# EAGLE schematic rel-8bit-computer (EAGLE 9.6.2)
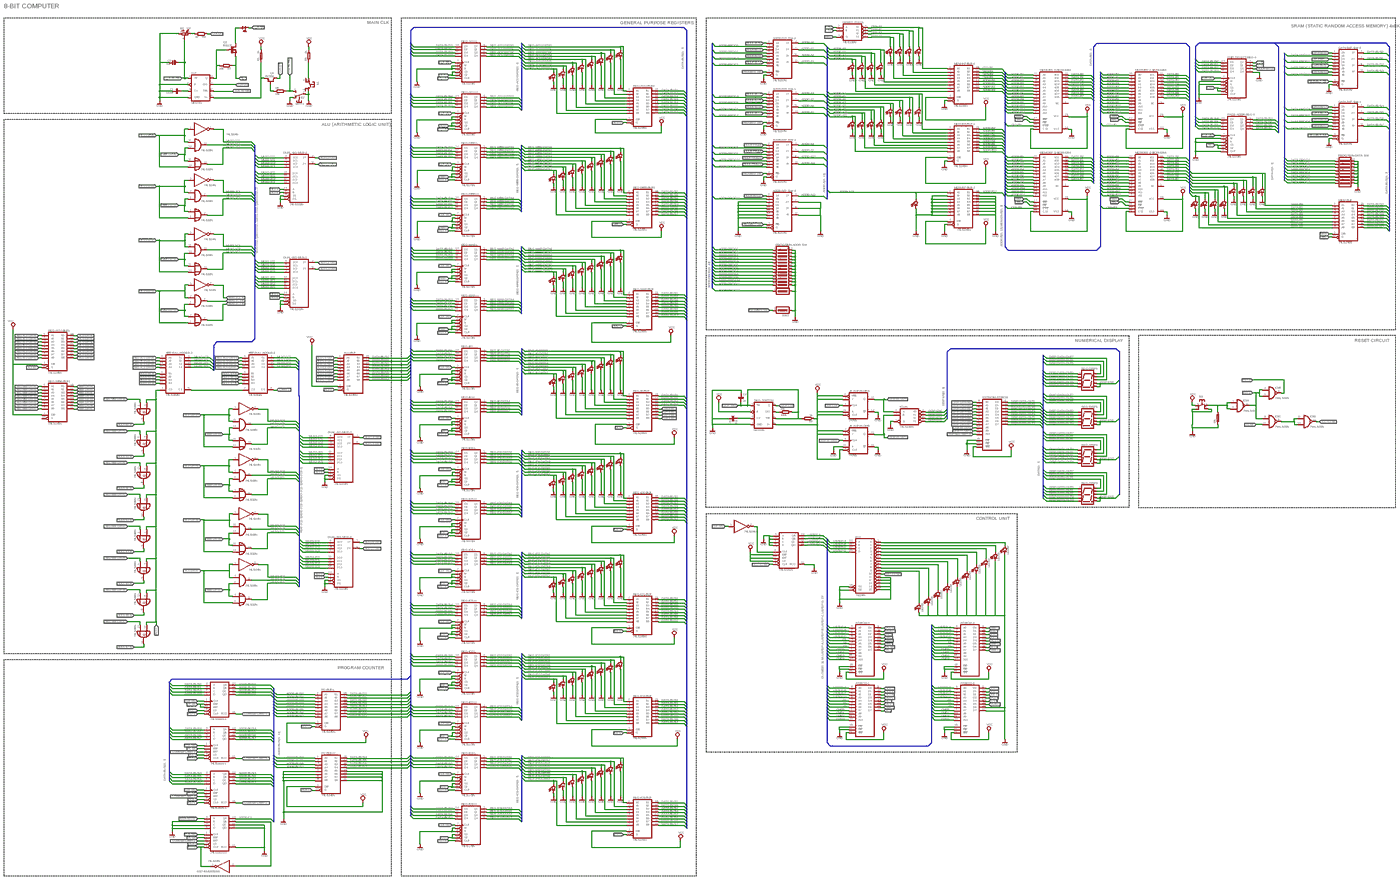
[diagram p0: schematic, sheet 1, overview]
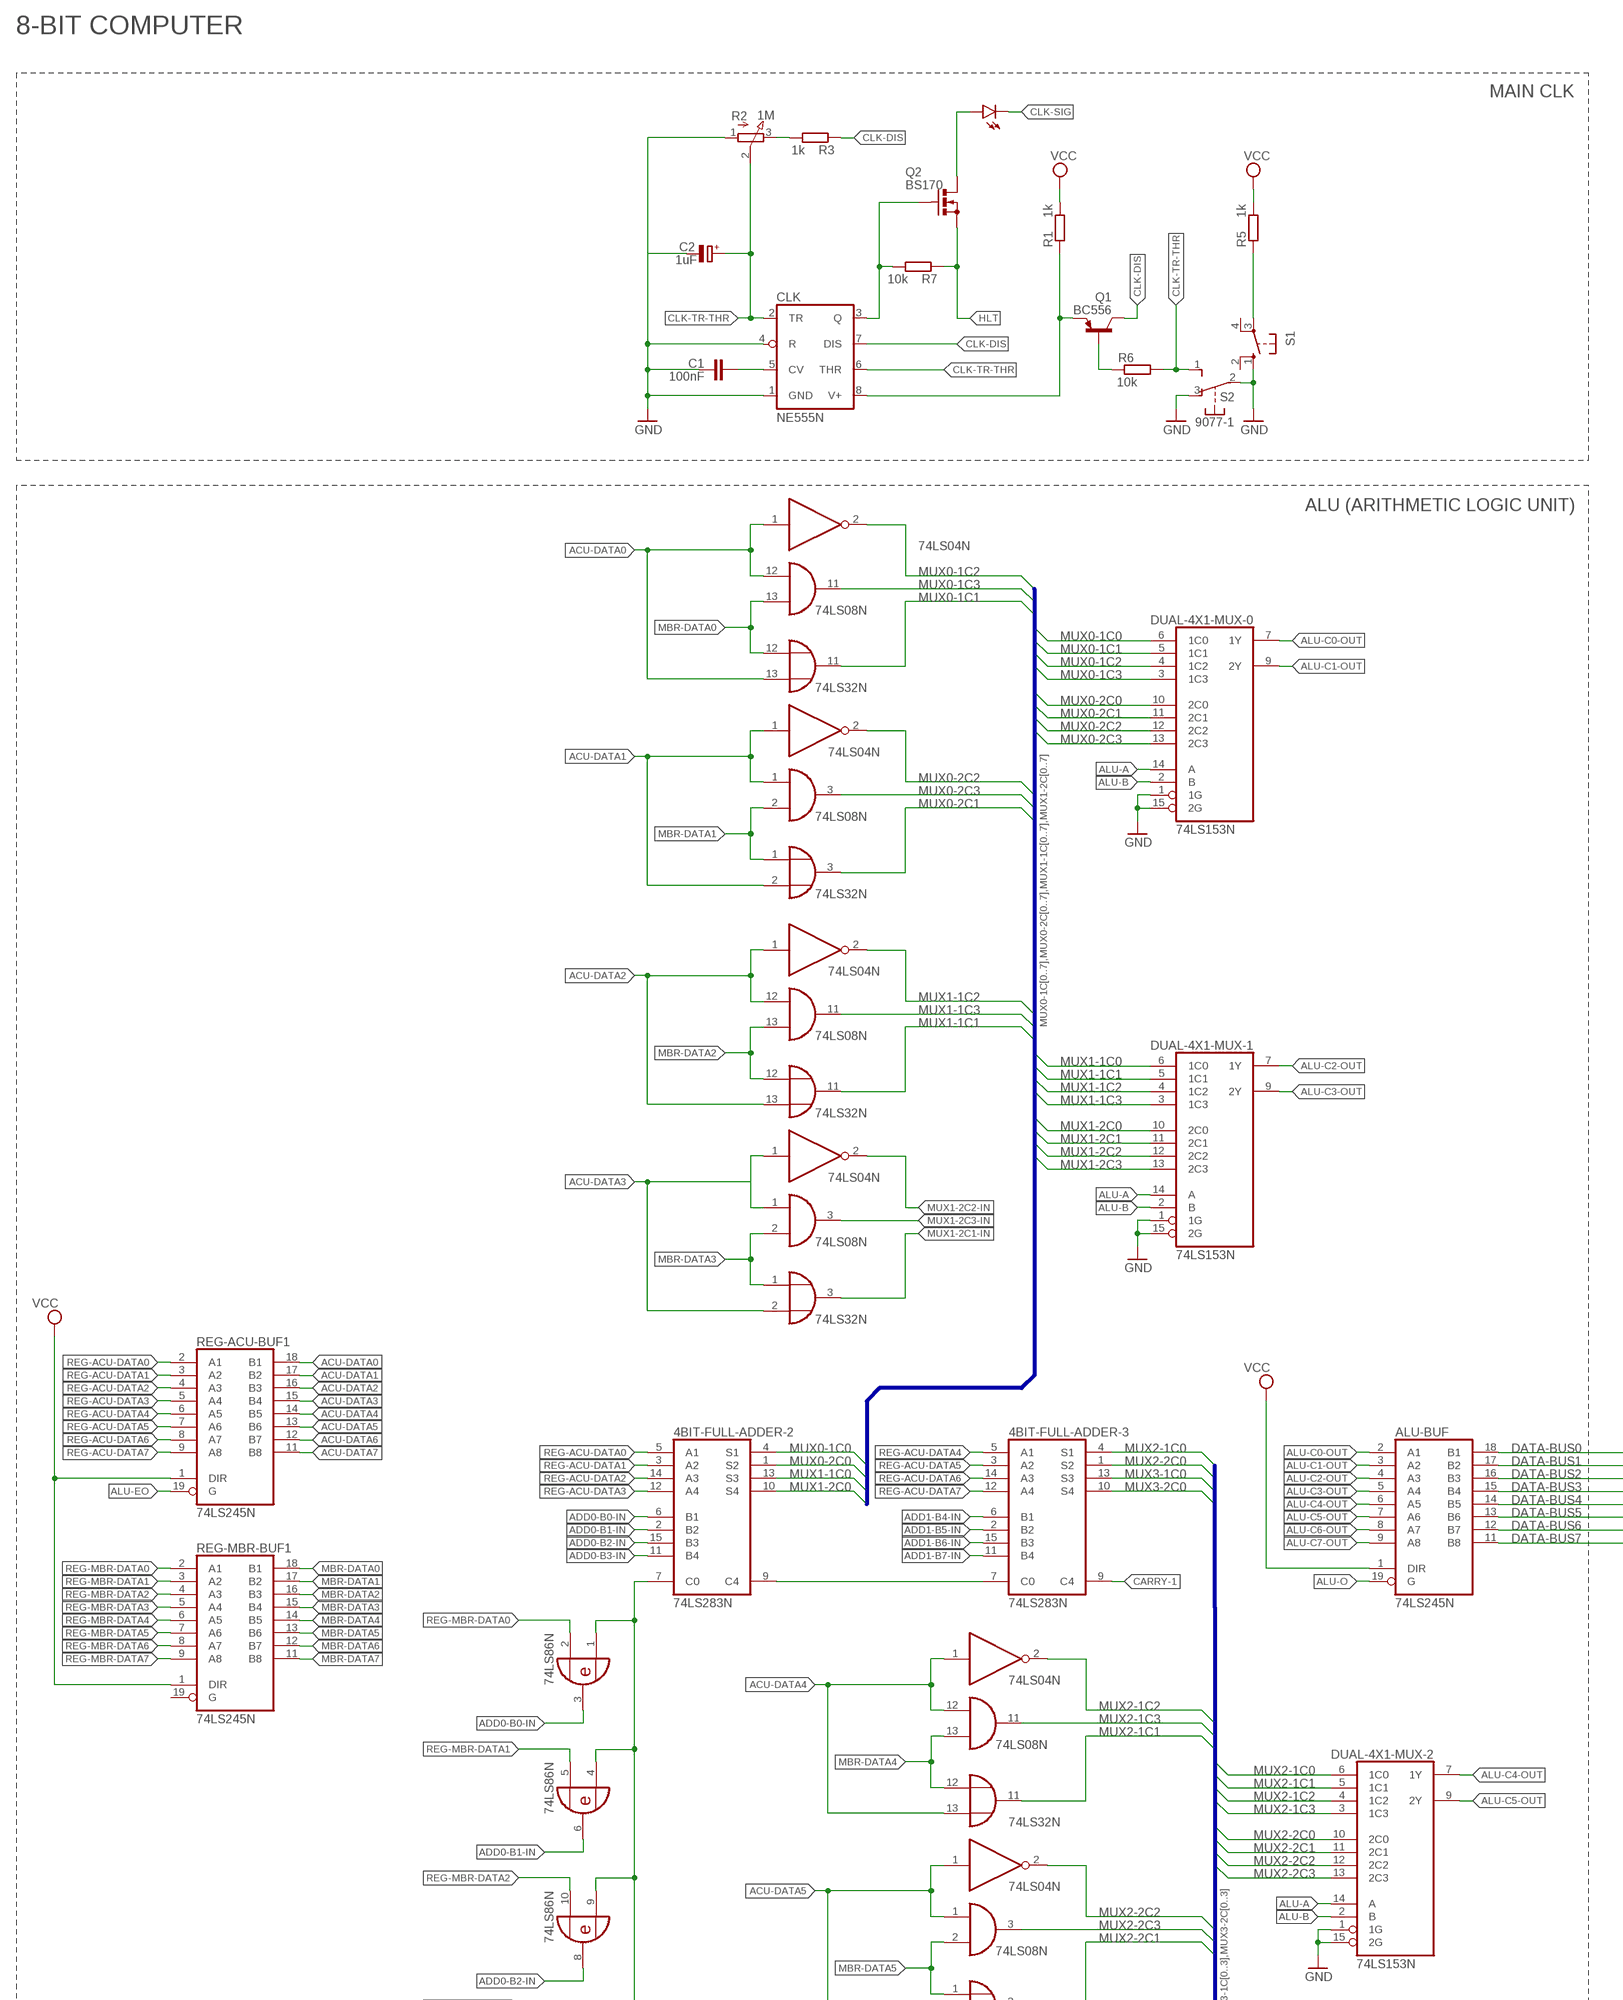
[diagram p1: schematic, sheet 1, part 1 of 8]
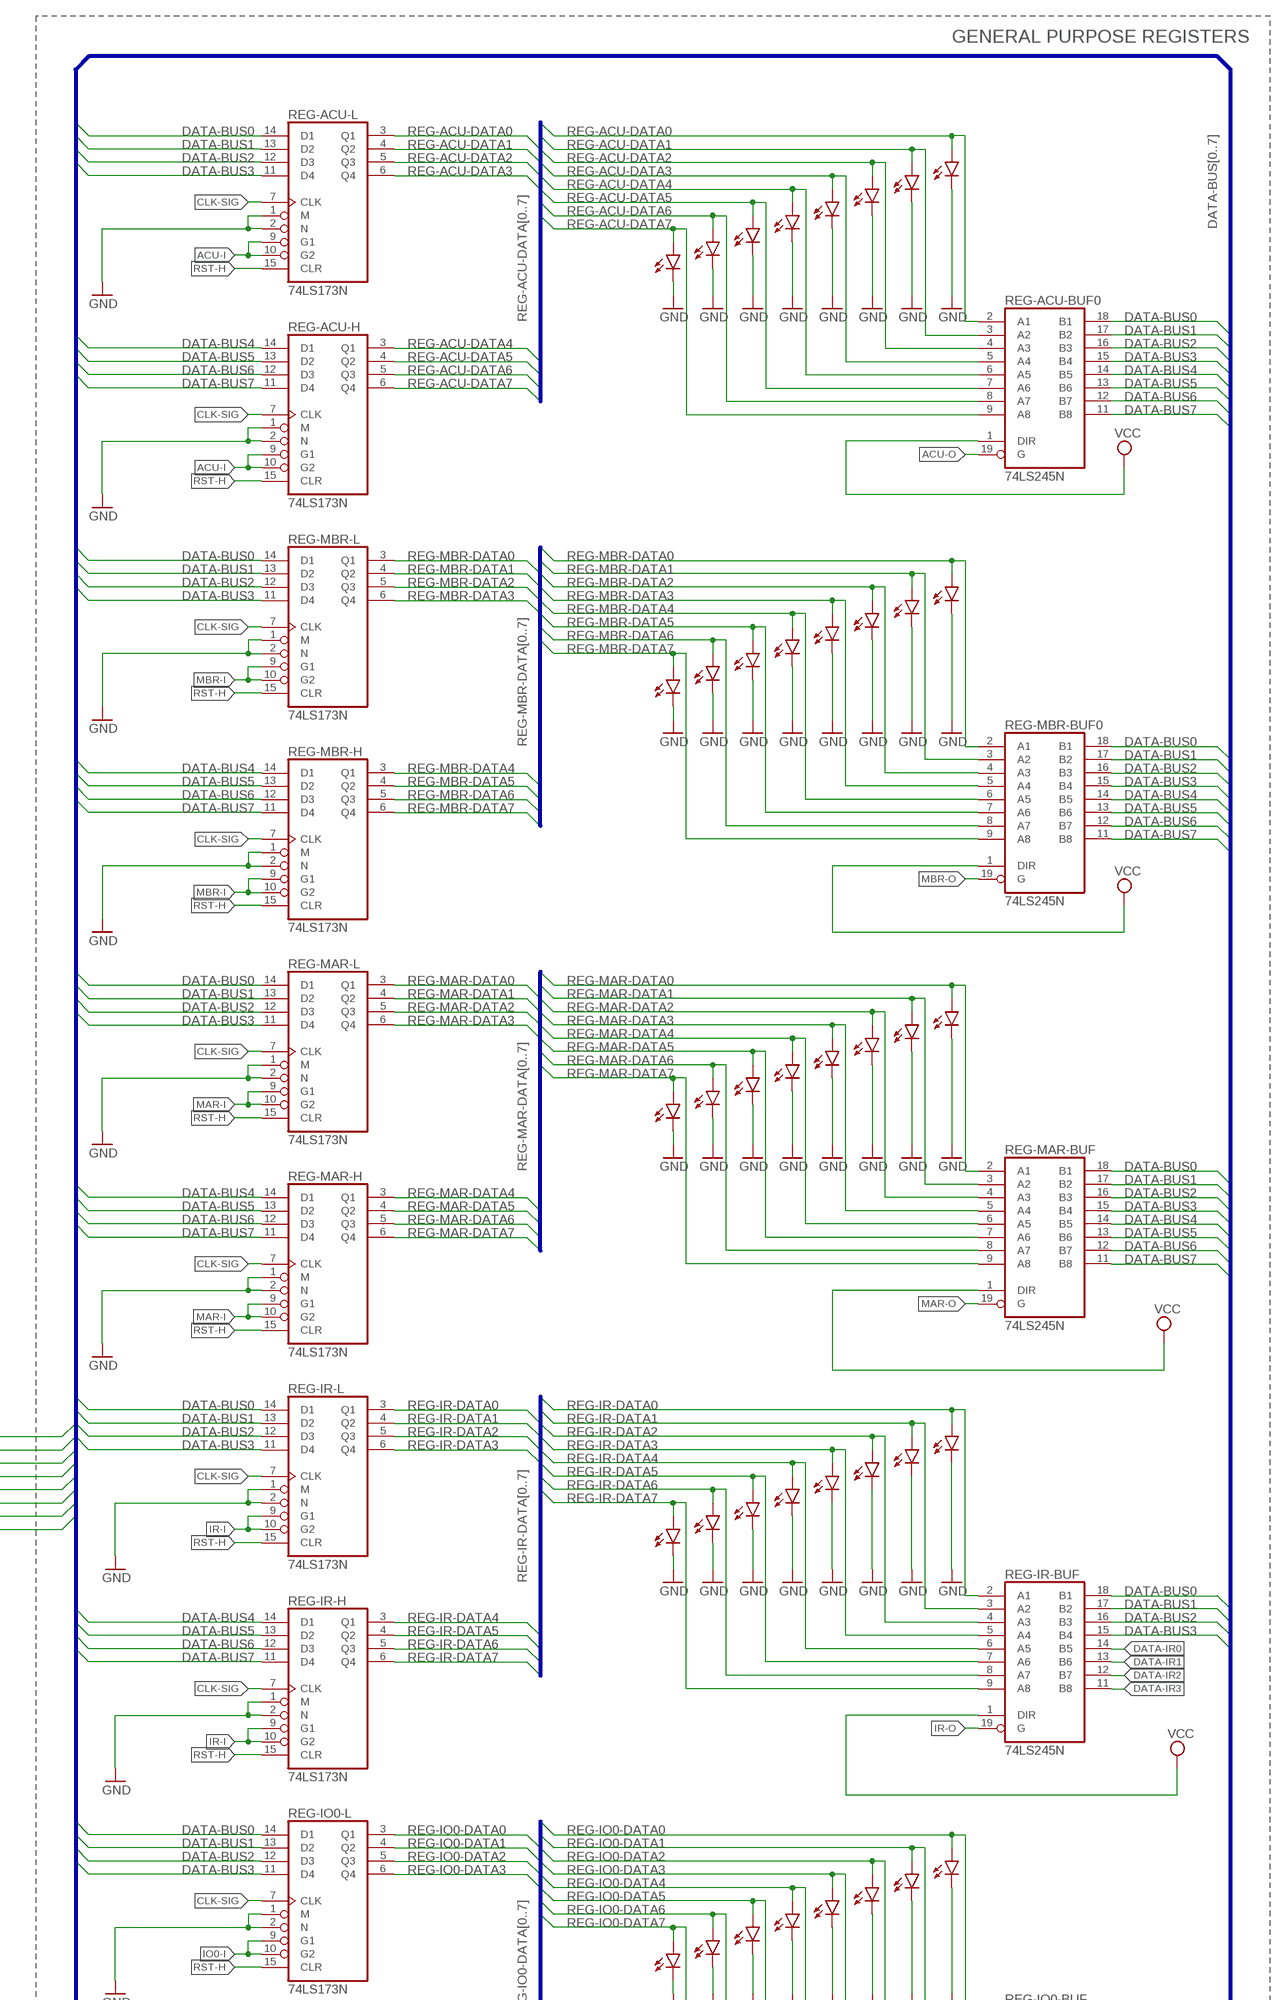
[diagram p2: schematic, sheet 1, part 2 of 8]
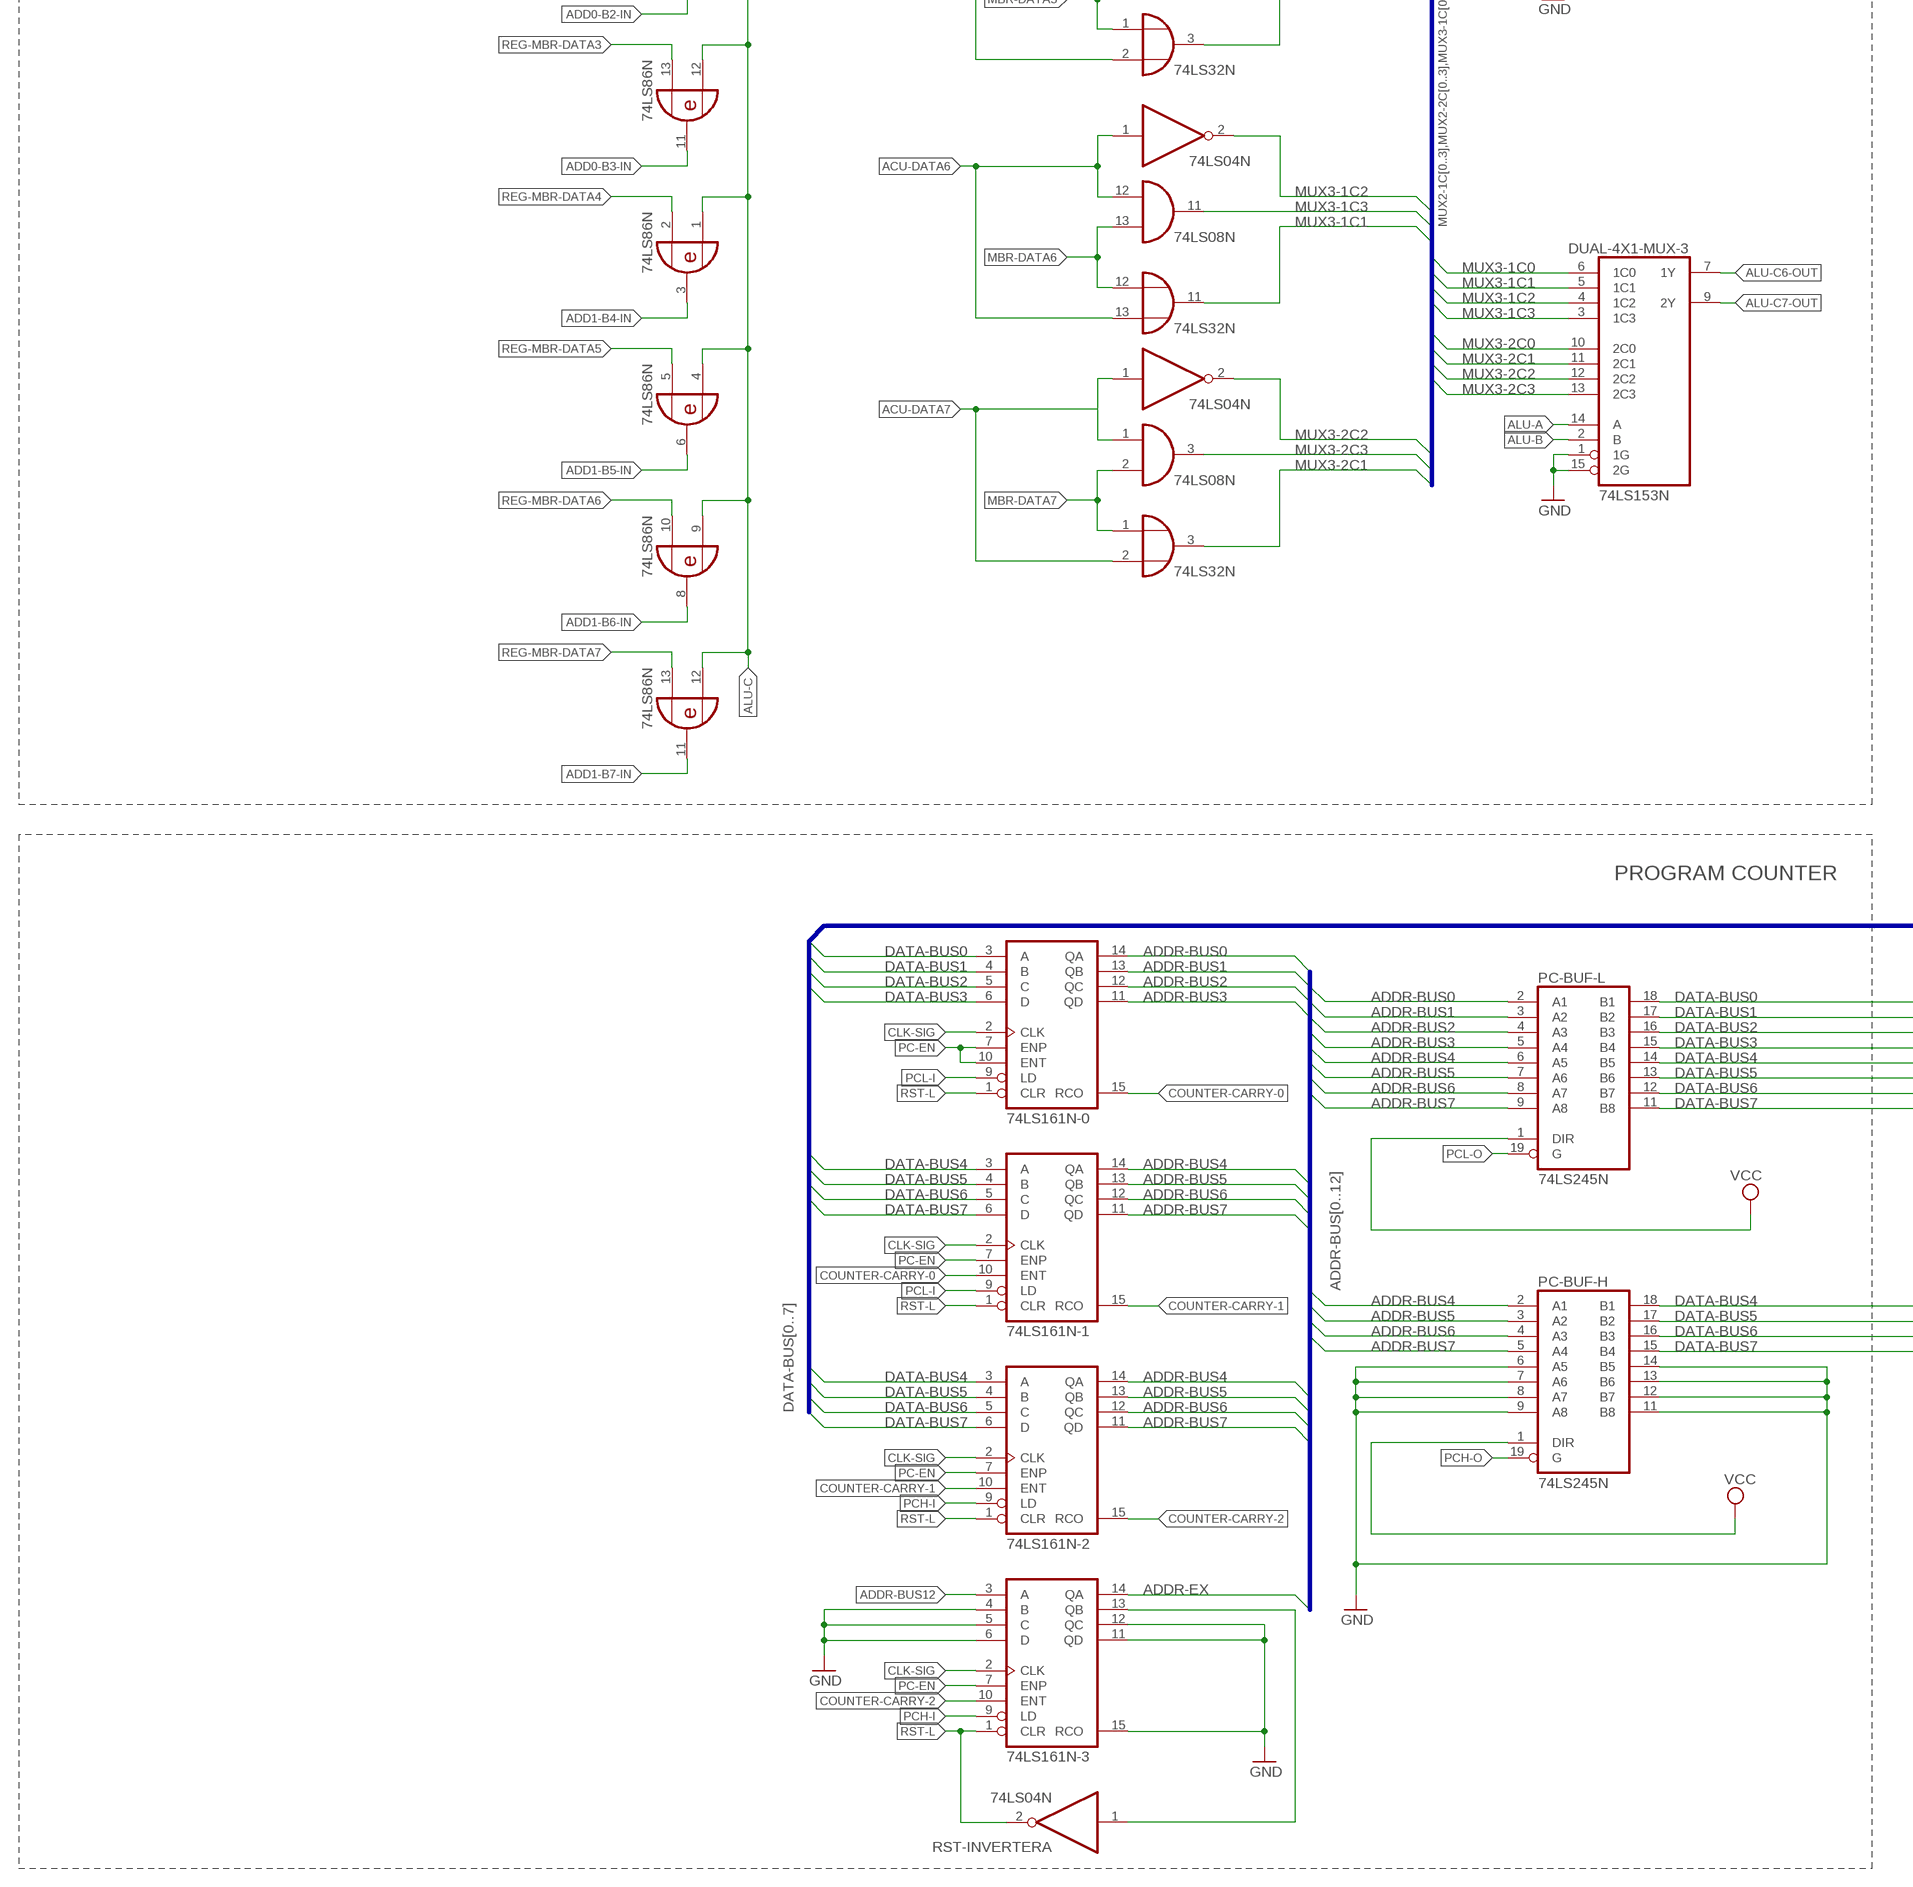
[diagram p3: schematic, sheet 1, part 3 of 8]
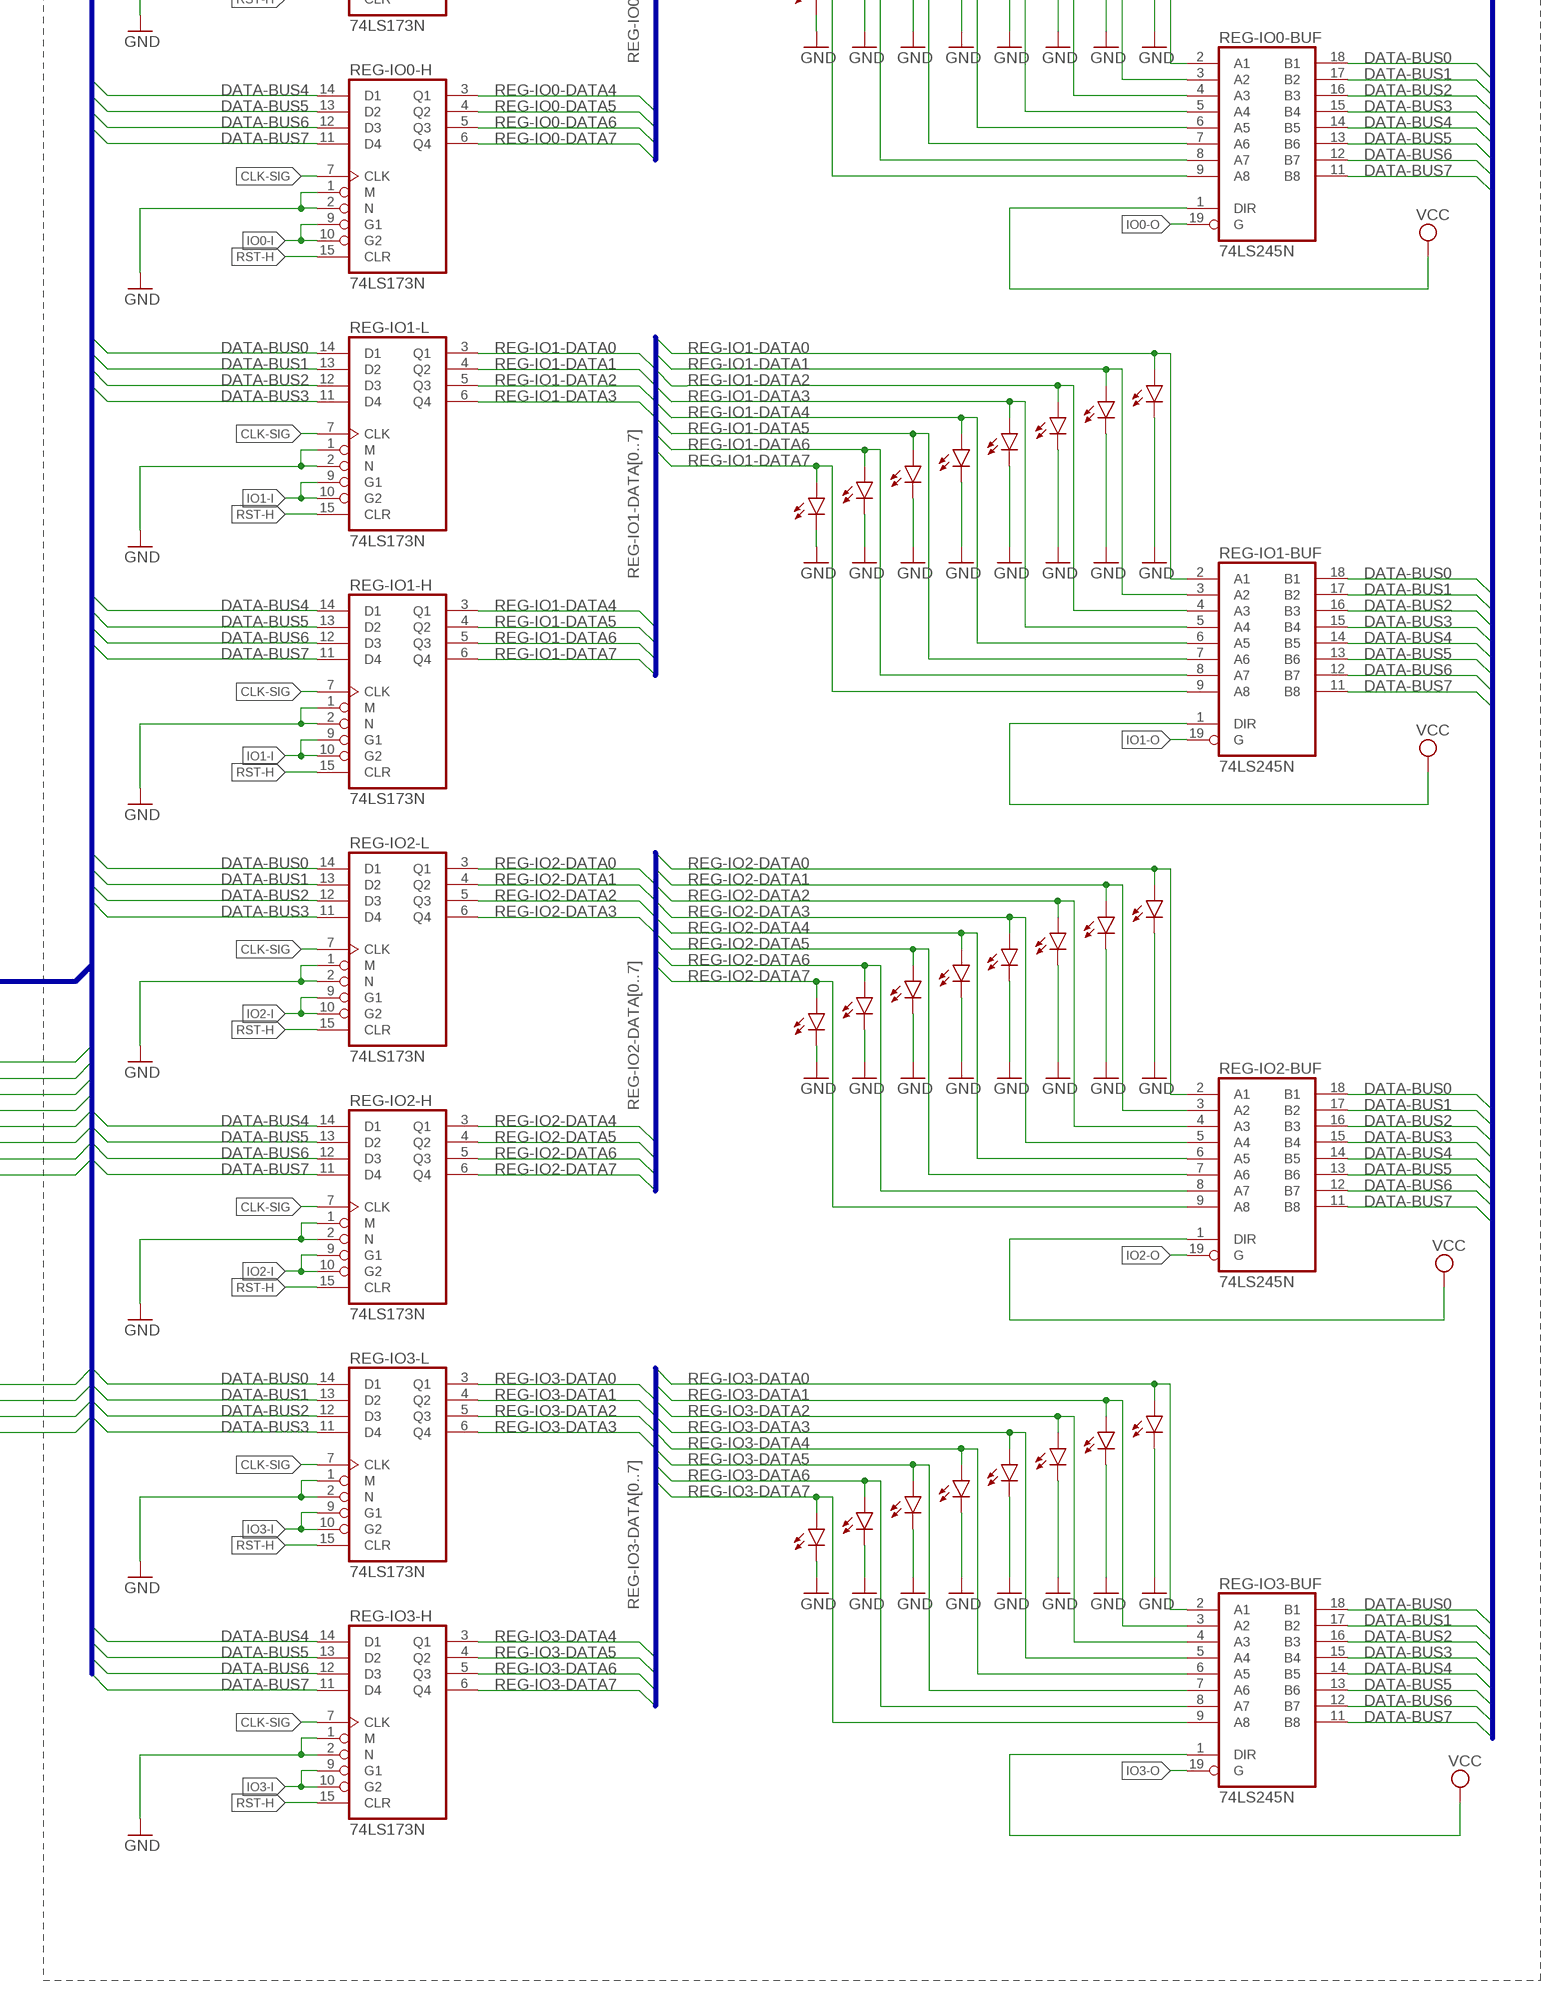
[diagram p4: schematic, sheet 1, part 4 of 8]
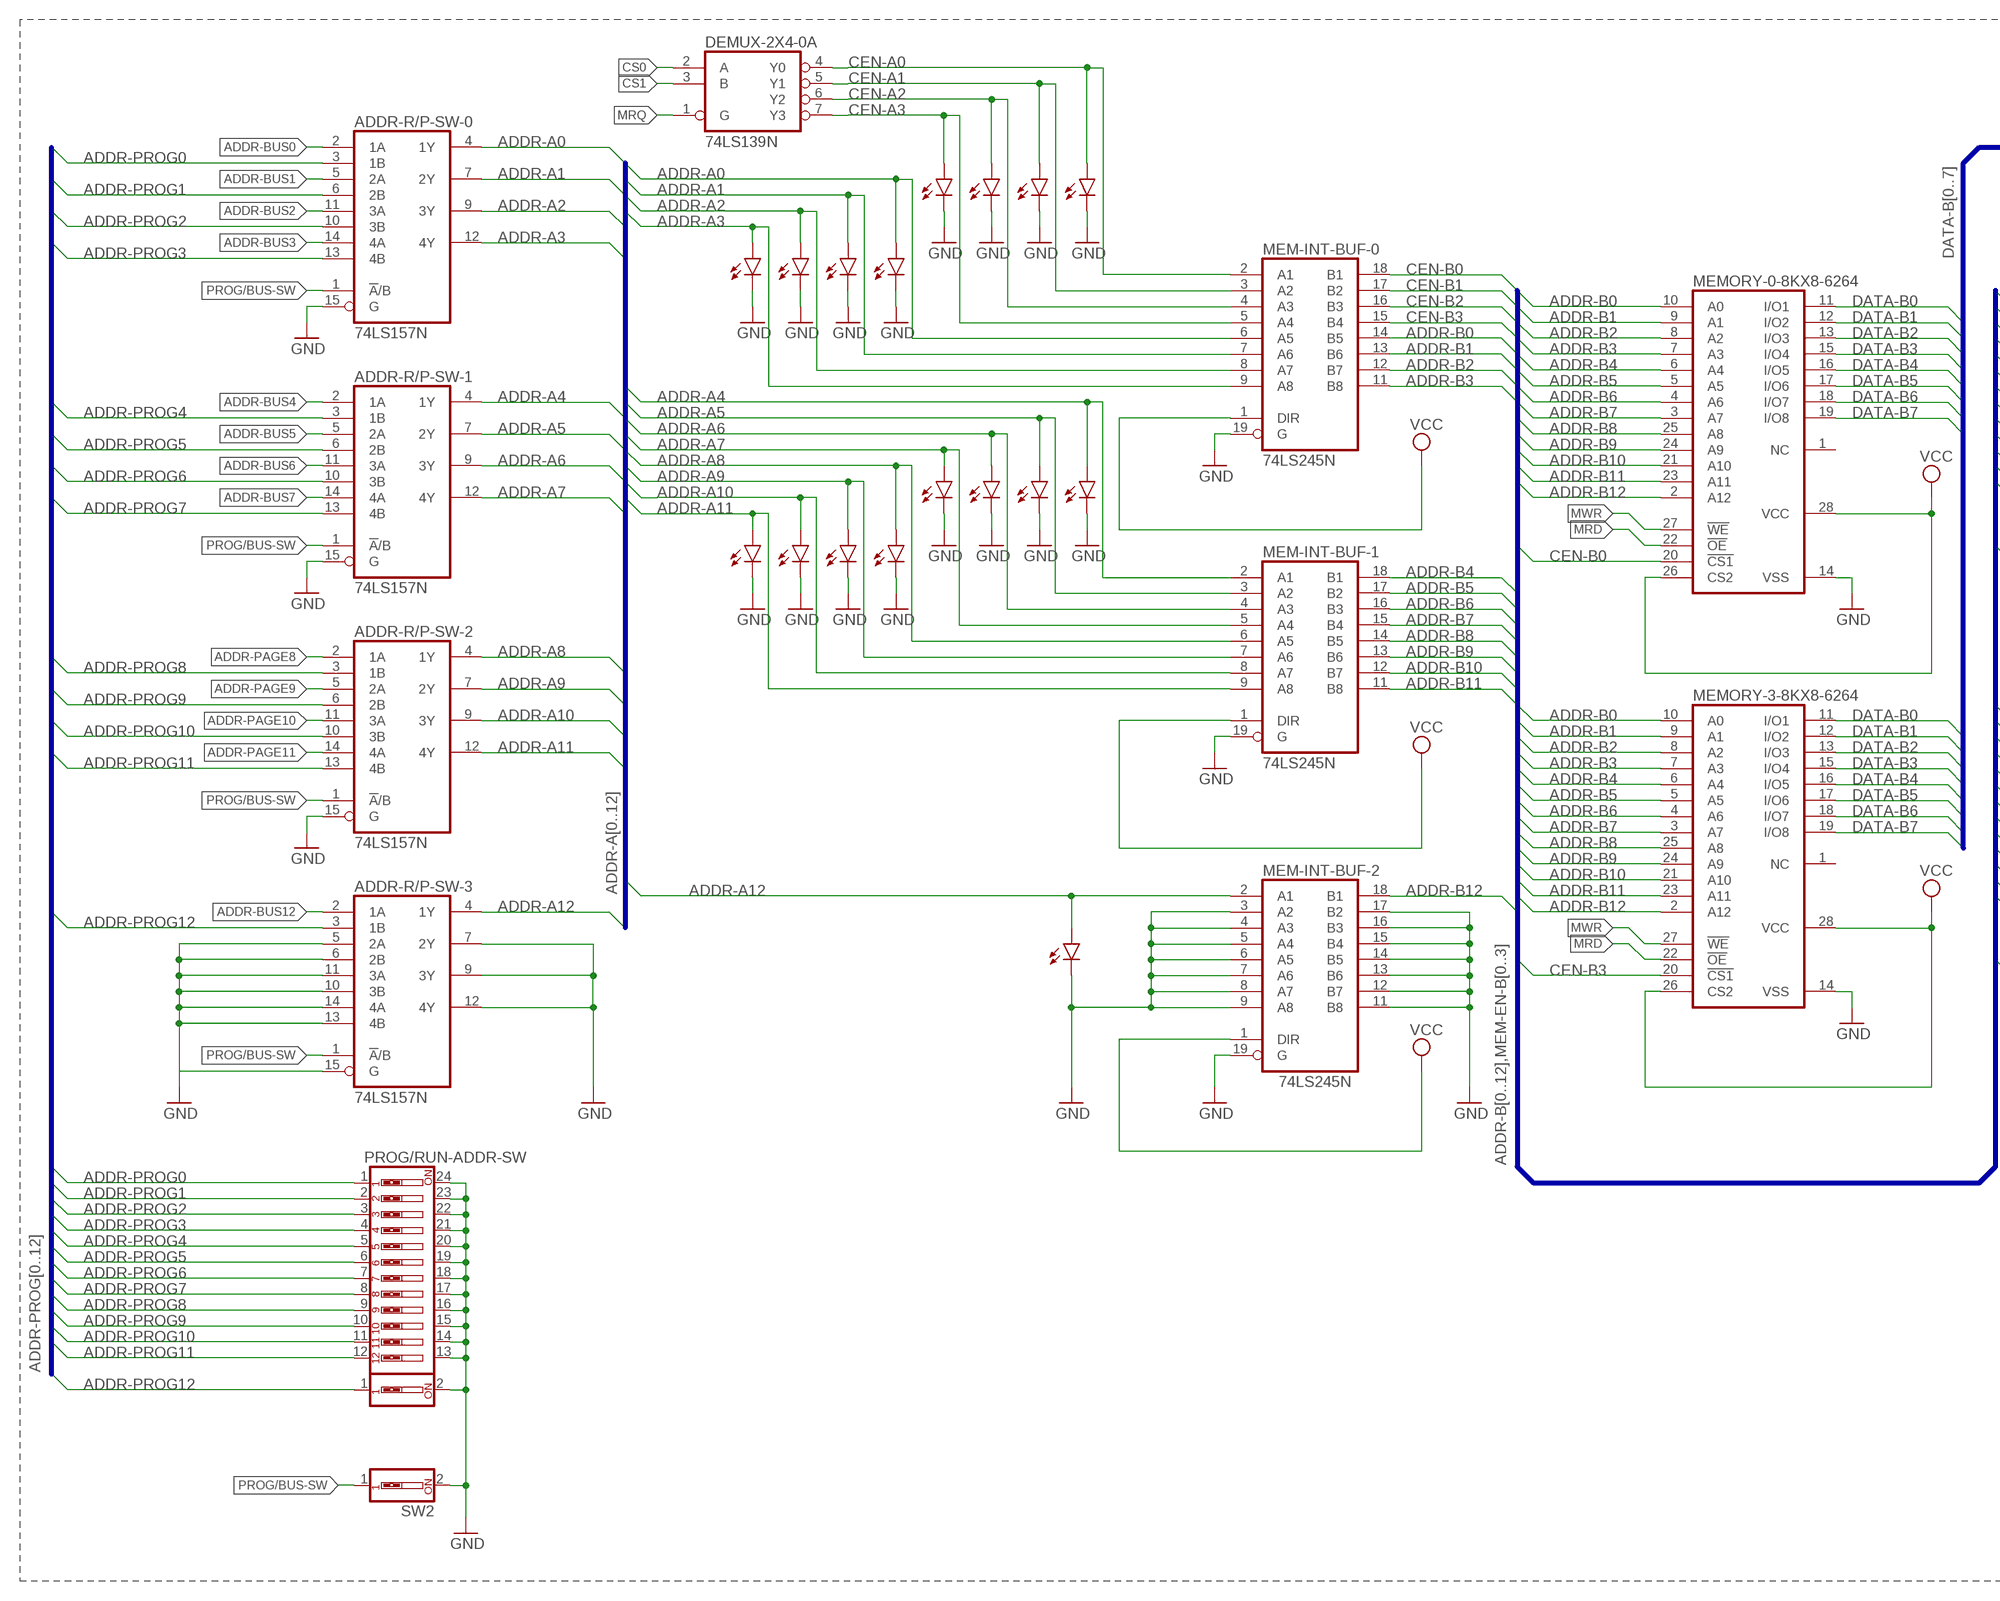
[diagram p5: schematic, sheet 1, part 5 of 8]
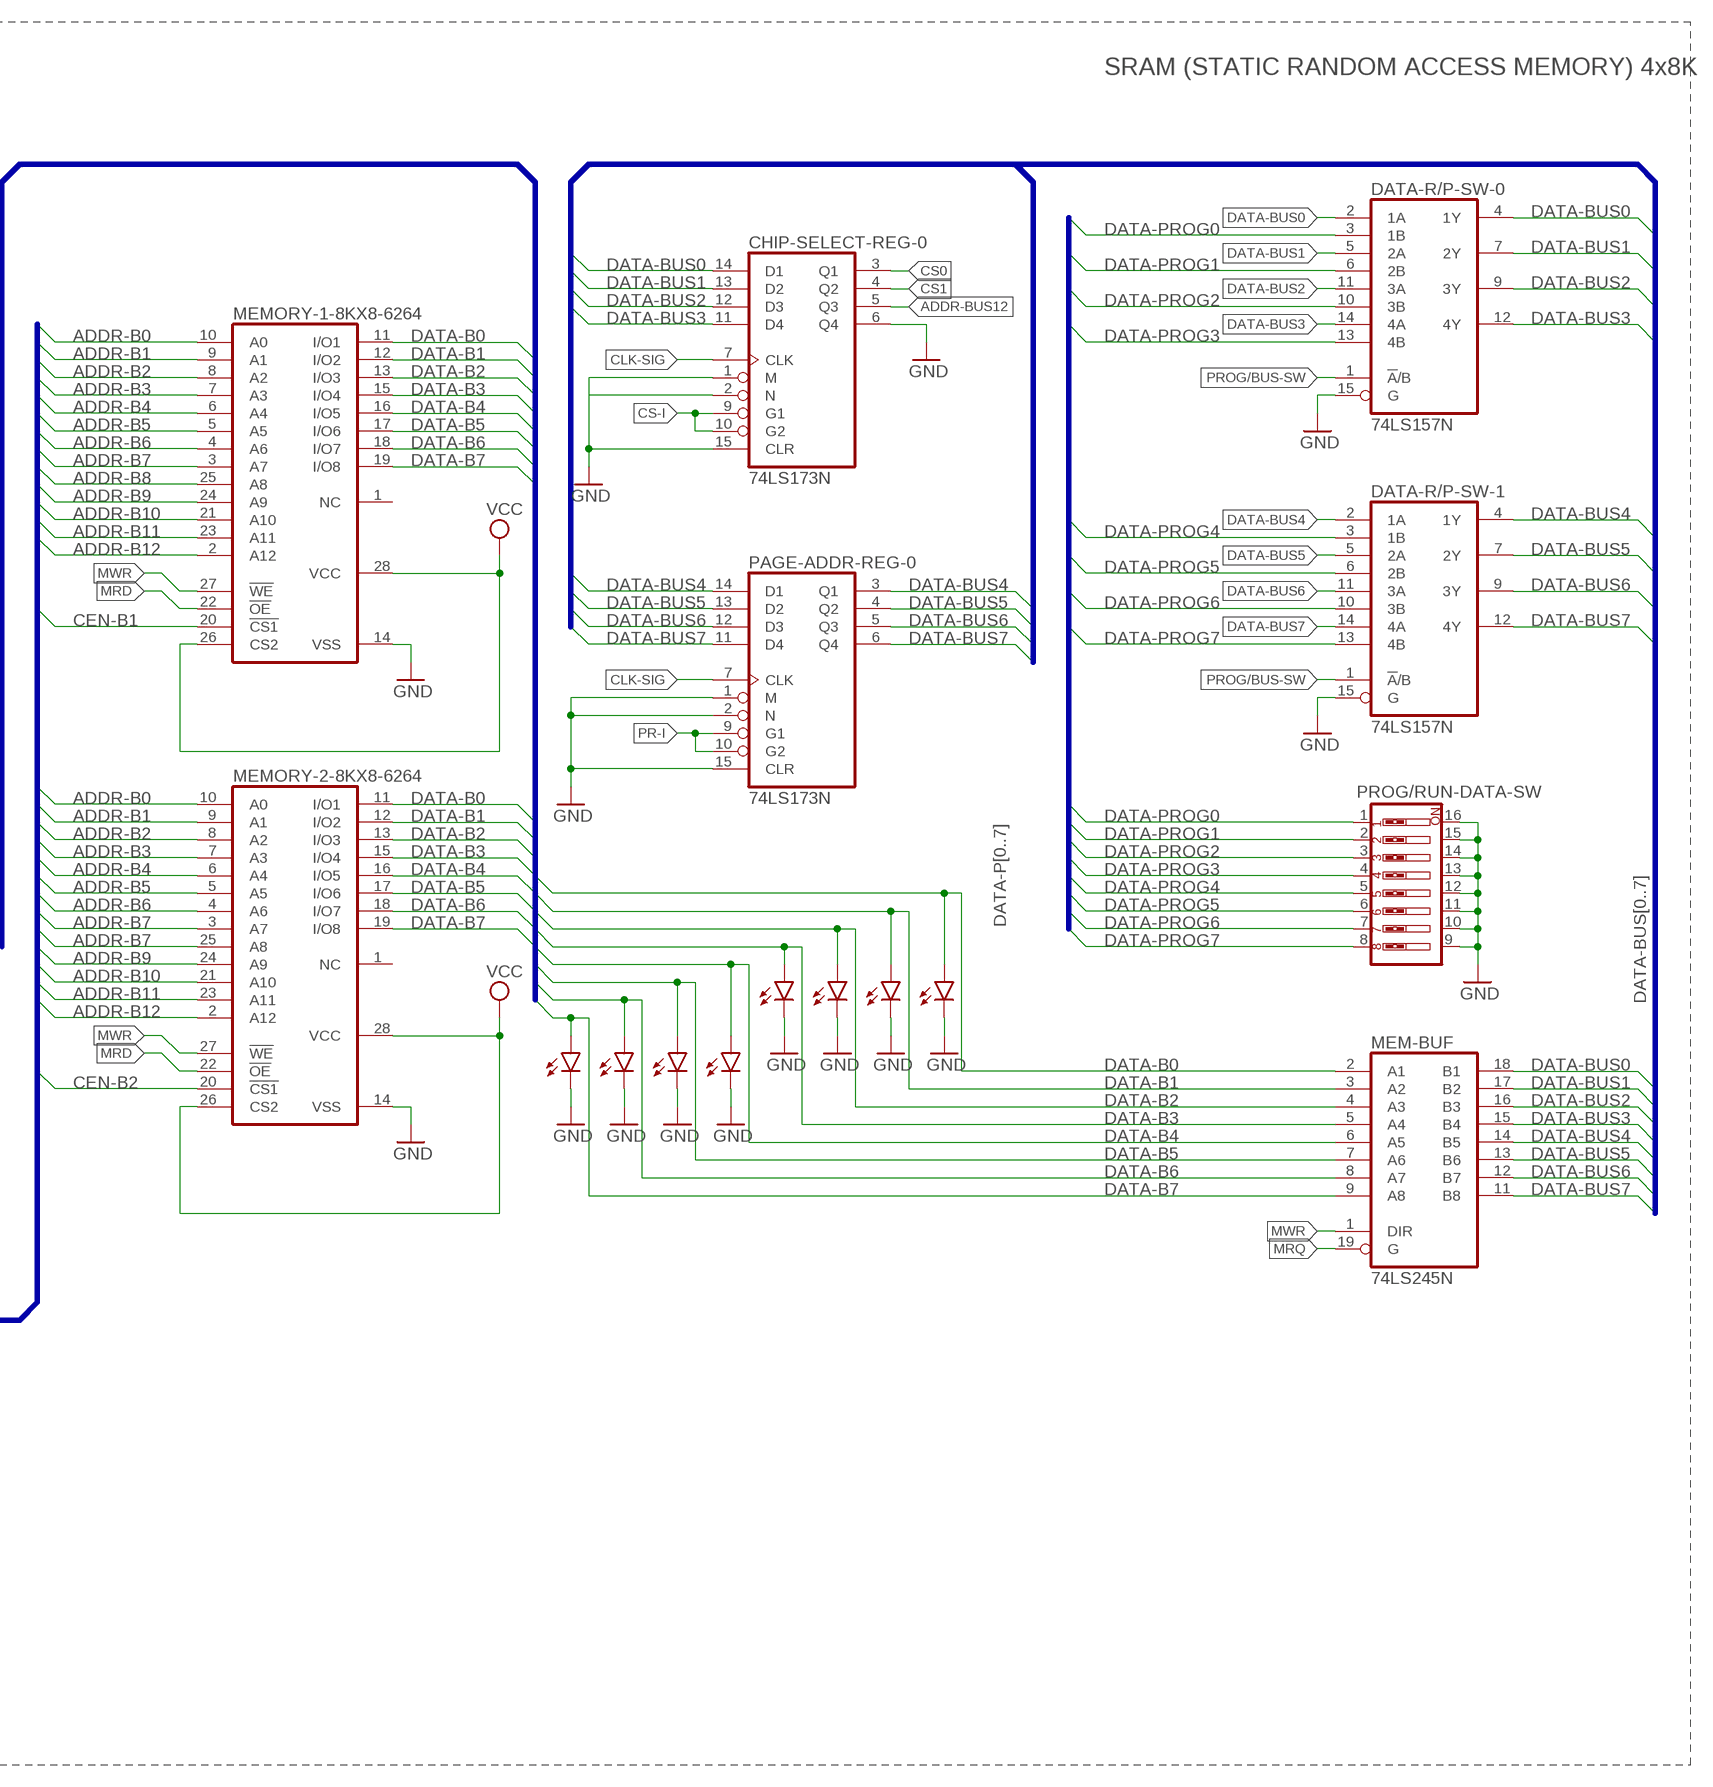
[diagram p6: schematic, sheet 1, part 6 of 8]
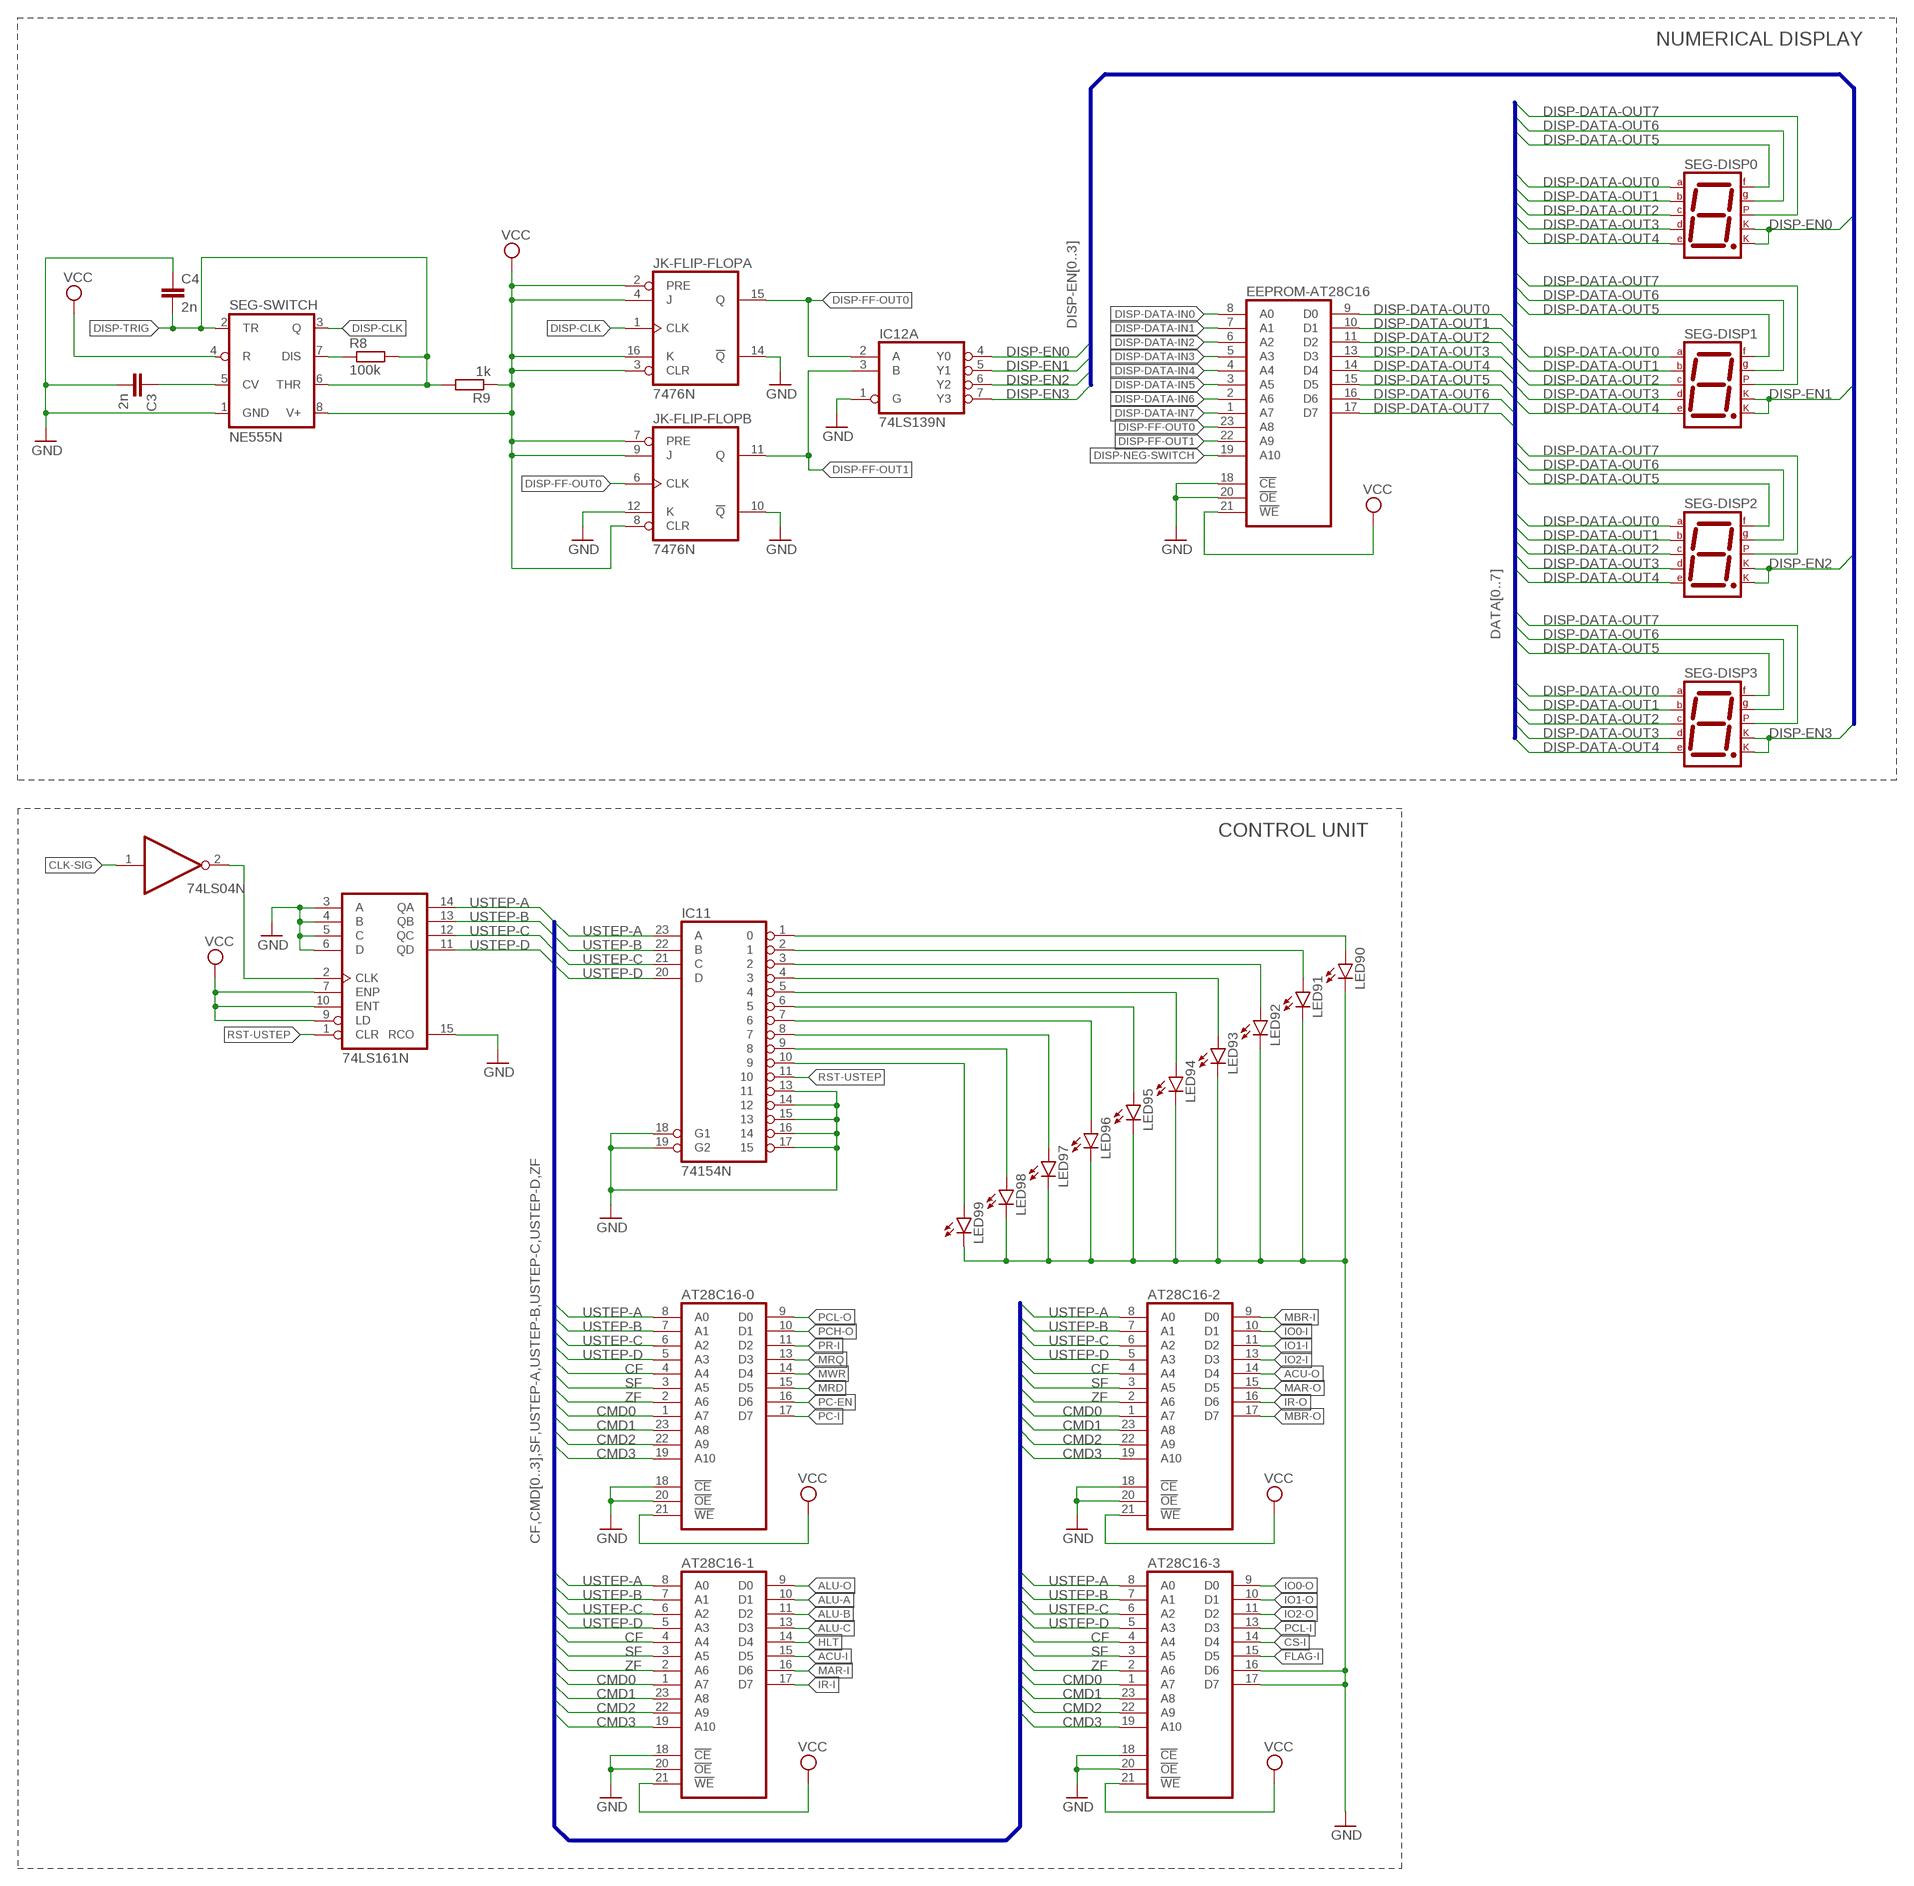
[diagram p7: schematic, sheet 1, part 7 of 8]
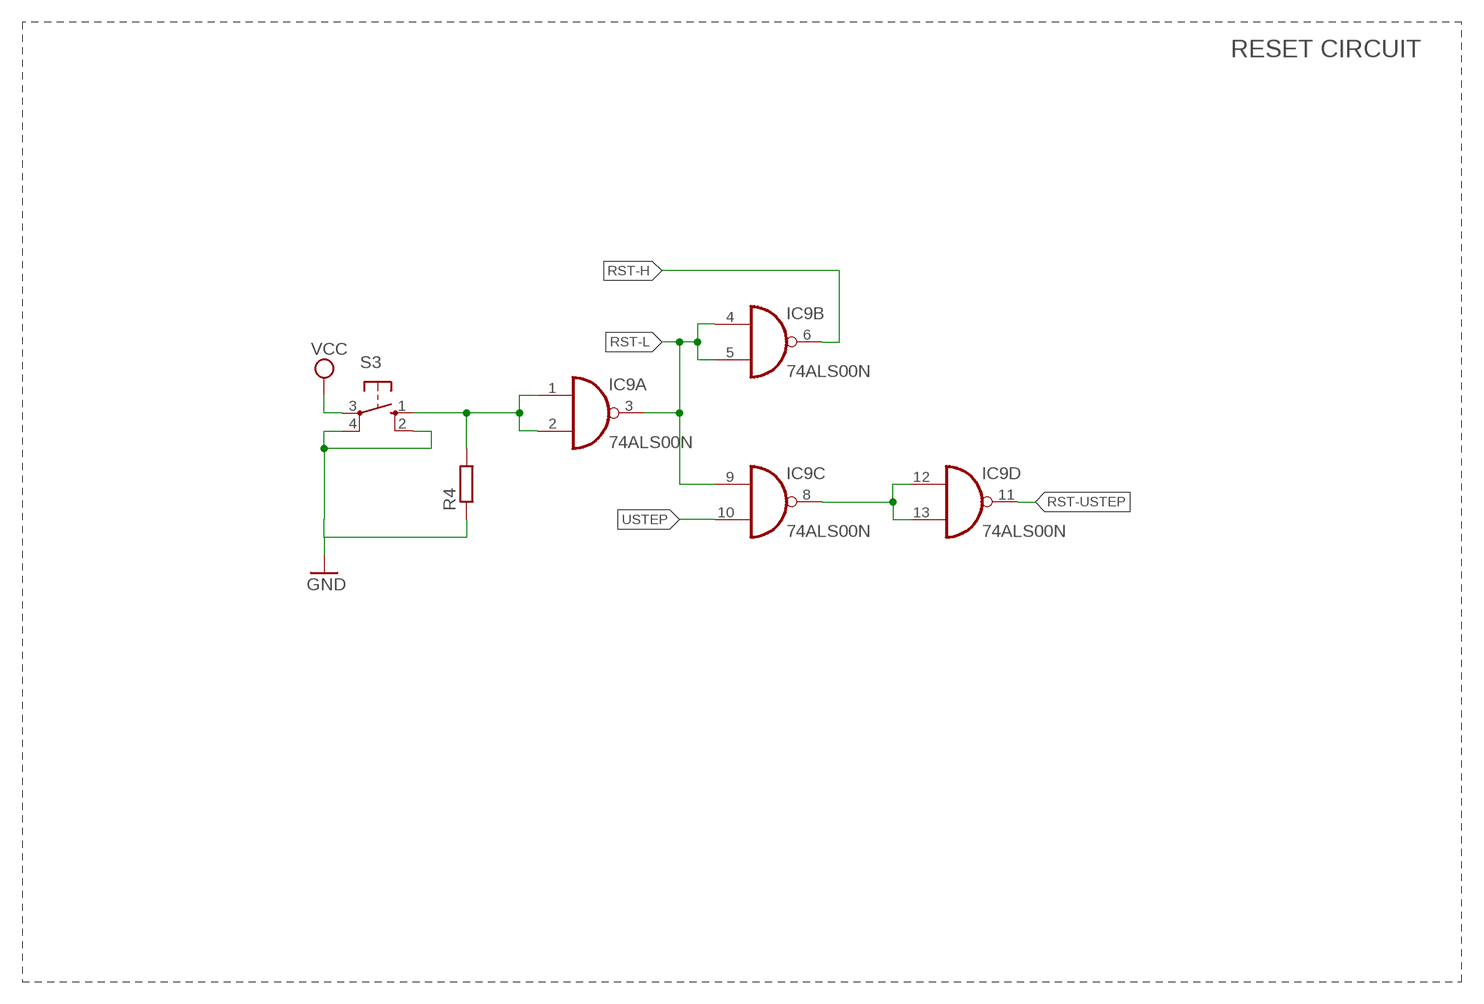
[diagram p8: schematic, sheet 1, part 8 of 8]

## Parts
4BIT-FULL-ADDER-2  74LS283N  [DIL16]
4BIT-FULL-ADDER-3  74LS283N  [DIL16]
74LS161N  74160N  [DIL16]
74LS161N-0  74160N  [DIL16]
74LS161N-1  74160N  [DIL16]
74LS161N-2  74160N  [DIL16]
74LS161N-3  74160N  [DIL16]
ADDR-R/P-SW-0  74LS157N  [DIL16]
ADDR-R/P-SW-1  74LS157N  [DIL16]
ADDR-R/P-SW-2  74LS157N  [DIL16]
ADDR-R/P-SW-3  74LS157N  [DIL16]
ALU-BUF  74LS245N  [DIL20]
AT28C16-0  2816  [DIL24]
AT28C16-1  2816  [DIL24]
AT28C16-2  2816  [DIL24]
AT28C16-3  2816  [DIL24]
C1  100nF  C-EU025-050X050  [C025-050X050]
C2  1uF  CPOL-EUE2-5  [E2-5]
C3  2n  C-EU025-025X050  [C025-025X050]
C4  2n  C-EU025-025X050  [C025-025X050]
CHIP-SELECT-REG-0  74LS173N  [DIL16]
CLK  NE555N  [DIL08]
DATA-R/P-SW-0  74LS157N  [DIL16]
DATA-R/P-SW-1  74LS157N  [DIL16]
DEMUX-2X4-0  74LS139N  [DIL16]
DUAL-4X1-MUX-0  74LS153N  [DIL16]
DUAL-4X1-MUX-1  74LS153N  [DIL16]
DUAL-4X1-MUX-2  74LS153N  [DIL16]
DUAL-4X1-MUX-3  74LS153N  [DIL16]
EEPROM-AT28C16  2816  [DIL24]
IC1  74LS04N  [DIL14]
IC2  74LS04N  [DIL14]
IC3  74LS04N  [DIL14]
IC4  74LS04N  [DIL14]
IC5  74LS04N  [DIL14]
IC6  74LS04N  [DIL14]
IC7  74LS04N  [DIL14]
IC8  74LS04N  [DIL14]
IC9  74ALS00N  [DIL14]
IC10  74LS04N  [DIL14]
IC11  74154N  [DIL24-6]
IC12  74LS139N  [DIL16]
IC35  74LS32N  [DIL14]
IC37  74LS08N  [DIL14]
IC38  74LS08N  [DIL14]
IC39  74LS32N  [DIL14]
IC41  74LS08N  [DIL14]
IC42  74LS32N  [DIL14]
IC44  74LS08N  [DIL14]
IC45  74LS32N  [DIL14]
IC46  74LS86N  [DIL14]
IC47  74LS86N  [DIL14]
IC48  74LS32N  [DIL14]
IC50  74LS08N  [DIL14]
IC51  74LS08N  [DIL14]
IC52  74LS32N  [DIL14]
IC54  74LS08N  [DIL14]
IC55  74LS32N  [DIL14]
IC57  74LS08N  [DIL14]
IC58  74LS32N  [DIL14]
JK-FLIP-FLOP  7476N  [DIL16]
LED0  LED5MM  [LED5MM]
LED1  LED5MM  [LED5MM]
LED2  LED5MM  [LED5MM]
LED3  LED5MM  [LED5MM]
LED4  LED5MM  [LED5MM]
LED5  LED5MM  [LED5MM]
LED6  LED5MM  [LED5MM]
LED7  LED5MM  [LED5MM]
LED8  LED5MM  [LED5MM]
LED9  LED5MM  [LED5MM]
LED10  LED5MM  [LED5MM]
LED11  LED5MM  [LED5MM]
LED12  LED5MM  [LED5MM]
LED13  LED5MM  [LED5MM]
LED14  LED5MM  [LED5MM]
LED15  LED5MM  [LED5MM]
LED16  LED5MM  [LED5MM]
LED17  LED5MM  [LED5MM]
LED18  LED5MM  [LED5MM]
LED19  LED5MM  [LED5MM]
LED20  LED5MM  [LED5MM]
LED21  LED5MM  [LED5MM]
LED22  LED5MM  [LED5MM]
LED23  LED5MM  [LED5MM]
LED24  LED5MM  [LED5MM]
LED25  LED5MM  [LED5MM]
LED26  LED5MM  [LED5MM]
LED27  LED5MM  [LED5MM]
LED28  LED5MM  [LED5MM]
LED29  LED5MM  [LED5MM]
LED30  LED5MM  [LED5MM]
LED31  LED5MM  [LED5MM]
LED32  LED5MM  [LED5MM]
LED33  LED5MM  [LED5MM]
LED34  LED5MM  [LED5MM]
LED35  LED5MM  [LED5MM]
LED36  LED5MM  [LED5MM]
LED37  LED5MM  [LED5MM]
LED38  LED5MM  [LED5MM]
LED39  LED5MM  [LED5MM]
LED40  LED5MM  [LED5MM]
LED41  LED5MM  [LED5MM]
LED42  LED5MM  [LED5MM]
LED43  LED5MM  [LED5MM]
LED44  LED5MM  [LED5MM]
LED45  LED5MM  [LED5MM]
LED46  LED5MM  [LED5MM]
LED47  LED5MM  [LED5MM]
LED48  LED5MM  [LED5MM]
LED49  LED5MM  [LED5MM]
LED50  LED5MM  [LED5MM]
LED51  LED5MM  [LED5MM]
LED52  LED5MM  [LED5MM]
LED53  LED5MM  [LED5MM]
LED54  LED5MM  [LED5MM]
LED55  LED5MM  [LED5MM]
LED56  LED5MM  [LED5MM]
LED57  LED5MM  [LED5MM]
LED58  LED5MM  [LED5MM]
LED59  LED5MM  [LED5MM]
LED60  LED5MM  [LED5MM]
LED61  LED5MM  [LED5MM]
LED62  LED5MM  [LED5MM]
LED63  LED5MM  [LED5MM]
LED64  LED5MM  [LED5MM]
LED65  LED5MM  [LED5MM]
LED66  LED5MM  [LED5MM]
LED67  LED5MM  [LED5MM]
LED68  LED5MM  [LED5MM]
LED69  LED5MM  [LED5MM]
LED70  LED5MM  [LED5MM]
LED71  LED5MM  [LED5MM]
LED72  LED5MM  [LED5MM]
LED73  LED5MM  [LED5MM]
LED74  LED5MM  [LED5MM]
LED75  LED5MM  [LED5MM]
LED76  LED5MM  [LED5MM]
LED77  LED5MM  [LED5MM]
LED78  LED5MM  [LED5MM]
LED79  LED5MM  [LED5MM]
LED80  LED5MM  [LED5MM]
LED81  LED5MM  [LED5MM]
LED82  LED5MM  [LED5MM]
LED83  LED5MM  [LED5MM]
LED84  LED5MM  [LED5MM]
LED85  LED5MM  [LED5MM]
LED86  LED5MM  [LED5MM]
LED87  LED5MM  [LED5MM]
LED88  LED5MM  [LED5MM]
LED89  LED5MM  [LED5MM]
LED90  LED5MM  [LED5MM]
LED91  LED5MM  [LED5MM]
LED92  LED5MM  [LED5MM]
LED93  LED5MM  [LED5MM]
LED94  LED5MM  [LED5MM]
LED95  LED5MM  [LED5MM]
LED96  LED5MM  [LED5MM]
LED97  LED5MM  [LED5MM]
LED98  LED5MM  [LED5MM]
LED99  LED5MM  [LED5MM]
MEM-BUF  74LS245N  [DIL20]
MEM-INT-BUF-0  74LS245N  [DIL20]
MEM-INT-BUF-1  74LS245N  [DIL20]
MEM-INT-BUF-2  74LS245N  [DIL20]
MEMORY-0-8KX8-6264  6264A  [DIL28-6]
MEMORY-1-8KX8-6264  6264A  [DIL28-6]
MEMORY-2-8KX8-6264  6264A  [DIL28-6]
MEMORY-3-8KX8-6264  6264A  [DIL28-6]
PAGE-ADDR-REG-0  74LS173N  [DIL16]
PC-BUF-H  74LS245N  [DIL20]
PC-BUF-L  74LS245N  [DIL20]
PROG/RUN-ADDR-SW  SW_DIP-12  [EDG-12]
PROG/RUN-DATA-SW  SW_DIP-8  [EDG-08]
Q1  BC556  [TO92-EBC]
Q2  BS170  [SOT54E]
R1  1k  R-EU_0204/5  [0204/5]
R2  1M  3RP/1610N  [3RP/1610N]
R3  1k  R-EU_0204/5  [0204/5]
R4  R-EU_0204/5  [0204/5]
R5  1k  R-EU_0204/5  [0204/5]
R6  10k  R-EU_0204/5  [0204/5]
R7  10k  R-EU_0204/5  [0204/5]
R8  100k  R-EU_0204/5  [0204/5]
R9  1k  R-EU_0204/5  [0204/5]
REG-ACU-BUF0  74LS245N  [DIL20]
REG-ACU-BUF1  74LS245N  [DIL20]
REG-ACU-H  74LS173N  [DIL16]
REG-ACU-L  74LS173N  [DIL16]
REG-IO0-BUF  74LS245N  [DIL20]
REG-IO0-H  74LS173N  [DIL16]
REG-IO0-L  74LS173N  [DIL16]
REG-IO1-BUF  74LS245N  [DIL20]
REG-IO1-H  74LS173N  [DIL16]
REG-IO1-L  74LS173N  [DIL16]
REG-IO2-BUF  74LS245N  [DIL20]
REG-IO2-H  74LS173N  [DIL16]
REG-IO2-L  74LS173N  [DIL16]
REG-IO3-BUF  74LS245N  [DIL20]
REG-IO3-H  74LS173N  [DIL16]
REG-IO3-L  74LS173N  [DIL16]
REG-IR-BUF  74LS245N  [DIL20]
REG-IR-H  74LS173N  [DIL16]
REG-IR-L  74LS173N  [DIL16]
REG-MAR-BUF  74LS245N  [DIL20]
REG-MAR-H  74LS173N  [DIL16]
REG-MAR-L  74LS173N  [DIL16]
REG-MBR-BUF0  74LS245N  [DIL20]
REG-MBR-BUF1  74LS245N  [DIL20]
REG-MBR-H  74LS173N  [DIL16]
REG-MBR-L  74LS173N  [DIL16]
RST-INVERTER  74LS04N  [DIL14]
S1  10-XX  [B3F-10XX]
S2  9077-1  [9077-1]
S3  10-XX  [B3F-10XX]
SEG-DISP0  7SEG-CK  [7SEG-13]
SEG-DISP1  7SEG-CK  [7SEG-13]
SEG-DISP2  7SEG-CK  [7SEG-13]
SEG-DISP3  7SEG-CK  [7SEG-13]
SEG-SWITCH  NE555N  [DIL08]
SW2  SW_DIP-1  [EDG-01]
SW3  SW_DIP-1  [EDG-01]

## Nets
ACU-DATA0: IC1.1(A:I) IC35.13(D:I1) IC37.12(D:I0) REG-ACU-BUF1.18(B1)
ACU-DATA1: IC2.1(A:I) IC38.1(A:I0) IC39.2(A:I1) REG-ACU-BUF1.17(B2)
ACU-DATA2: IC3.1(A:I) IC41.12(D:I0) IC42.13(D:I1) REG-ACU-BUF1.16(B3)
ACU-DATA3: IC4.1(A:I) IC44.1(A:I0) IC45.2(A:I1) REG-ACU-BUF1.15(B4)
ACU-DATA4: IC5.1(A:I) IC48.13(D:I1) IC50.12(D:I0) REG-ACU-BUF1.14(B5)
ACU-DATA5: IC6.1(A:I) IC51.1(A:I0) IC52.2(A:I1) REG-ACU-BUF1.13(B6)
ACU-DATA6: IC7.1(A:I) IC54.12(D:I0) IC55.13(D:I1) REG-ACU-BUF1.12(B7)
ACU-DATA7: IC8.1(A:I) IC57.1(A:I0) IC58.2(A:I1) REG-ACU-BUF1.11(B8)
ACU-I: AT28C16-1.15(D5) REG-ACU-H.9(G1) REG-ACU-H.10(G2) REG-ACU-L.9(G1) REG-ACU-L.10(G2)
ACU-O: AT28C16-2.14(D4) REG-ACU-BUF0.19(G)
ADD0-B0-IN: 4BIT-FULL-ADDER-2.6(B1) IC46.3(A:O)
ADD0-B1-IN: 4BIT-FULL-ADDER-2.2(B2) IC46.6(B:O)
ADD0-B2-IN: 4BIT-FULL-ADDER-2.15(B3) IC46.8(C:O)
ADD0-B3-IN: 4BIT-FULL-ADDER-2.11(B4) IC46.11(D:O)
ADD1-B4-IN: 4BIT-FULL-ADDER-3.6(B1) IC47.3(A:O)
ADD1-B5-IN: 4BIT-FULL-ADDER-3.2(B2) IC47.6(B:O)
ADD1-B6-IN: 4BIT-FULL-ADDER-3.15(B3) IC47.8(C:O)
ADD1-B7-IN: 4BIT-FULL-ADDER-3.11(B4) IC47.11(D:O)
ADDR-A0: ADDR-R/P-SW-0.4(1Y) LED2.A MEM-INT-BUF-0.6(A5)
ADDR-A1: ADDR-R/P-SW-0.7(2Y) LED3.A MEM-INT-BUF-0.7(A6)
ADDR-A2: ADDR-R/P-SW-0.9(3Y) LED4.A MEM-INT-BUF-0.8(A7)
ADDR-A3: ADDR-R/P-SW-0.12(4Y) LED5.A MEM-INT-BUF-0.9(A8)
ADDR-A4: ADDR-R/P-SW-1.4(1Y) LED6.A MEM-INT-BUF-1.2(A1)
ADDR-A5: ADDR-R/P-SW-1.7(2Y) LED7.A MEM-INT-BUF-1.3(A2)
ADDR-A6: ADDR-R/P-SW-1.9(3Y) LED11.A MEM-INT-BUF-1.4(A3)
ADDR-A7: ADDR-R/P-SW-1.12(4Y) LED8.A MEM-INT-BUF-1.5(A4)
ADDR-A8: ADDR-R/P-SW-2.4(1Y) LED9.A MEM-INT-BUF-1.6(A5)
ADDR-A9: ADDR-R/P-SW-2.7(2Y) LED10.A MEM-INT-BUF-1.7(A6)
ADDR-A10: ADDR-R/P-SW-2.9(3Y) LED16.A MEM-INT-BUF-1.8(A7)
ADDR-A11: ADDR-R/P-SW-2.12(4Y) LED17.A MEM-INT-BUF-1.9(A8)
ADDR-A12: ADDR-R/P-SW-3.4(1Y) LED26.A MEM-INT-BUF-2.2(A1)
ADDR-B0: MEM-INT-BUF-0.14(B5) MEMORY-0-8KX8-6264.10(A0) MEMORY-1-8KX8-6264.10(A0) MEMORY-2-8KX8-6264.10(A0) MEMORY-3-8KX8-6264.10(A0)
ADDR-B1: MEM-INT-BUF-0.13(B6) MEMORY-0-8KX8-6264.9(A1) MEMORY-1-8KX8-6264.9(A1) MEMORY-2-8KX8-6264.9(A1) MEMORY-3-8KX8-6264.9(A1)
ADDR-B2: MEM-INT-BUF-0.12(B7) MEMORY-0-8KX8-6264.8(A2) MEMORY-1-8KX8-6264.8(A2) MEMORY-2-8KX8-6264.8(A2) MEMORY-3-8KX8-6264.8(A2)
ADDR-B3: MEM-INT-BUF-0.11(B8) MEMORY-0-8KX8-6264.7(A3) MEMORY-1-8KX8-6264.7(A3) MEMORY-2-8KX8-6264.7(A3) MEMORY-3-8KX8-6264.7(A3)
ADDR-B4: MEM-INT-BUF-1.18(B1) MEMORY-0-8KX8-6264.6(A4) MEMORY-1-8KX8-6264.6(A4) MEMORY-2-8KX8-6264.6(A4) MEMORY-3-8KX8-6264.6(A4)
ADDR-B5: MEM-INT-BUF-1.17(B2) MEMORY-0-8KX8-6264.5(A5) MEMORY-1-8KX8-6264.5(A5) MEMORY-2-8KX8-6264.5(A5) MEMORY-3-8KX8-6264.5(A5)
ADDR-B6: MEM-INT-BUF-1.16(B3) MEMORY-0-8KX8-6264.4(A6) MEMORY-1-8KX8-6264.4(A6) MEMORY-2-8KX8-6264.4(A6) MEMORY-3-8KX8-6264.4(A6)
ADDR-B7: MEM-INT-BUF-1.15(B4) MEMORY-0-8KX8-6264.3(A7) MEMORY-1-8KX8-6264.3(A7) MEMORY-2-8KX8-6264.3(A7) MEMORY-2-8KX8-6264.25(A8) MEMORY-3-8KX8-6264.3(A7)
ADDR-B8: MEM-INT-BUF-1.14(B5) MEMORY-0-8KX8-6264.25(A8) MEMORY-1-8KX8-6264.25(A8) MEMORY-3-8KX8-6264.25(A8)
ADDR-B9: MEM-INT-BUF-1.13(B6) MEMORY-0-8KX8-6264.24(A9) MEMORY-1-8KX8-6264.24(A9) MEMORY-2-8KX8-6264.24(A9) MEMORY-3-8KX8-6264.24(A9)
ADDR-B10: MEM-INT-BUF-1.12(B7) MEMORY-0-8KX8-6264.21(A10) MEMORY-1-8KX8-6264.21(A10) MEMORY-2-8KX8-6264.21(A10) MEMORY-3-8KX8-6264.21(A10)
ADDR-B11: MEM-INT-BUF-1.11(B8) MEMORY-0-8KX8-6264.23(A11) MEMORY-1-8KX8-6264.23(A11) MEMORY-2-8KX8-6264.23(A11) MEMORY-3-8KX8-6264.23(A11)
ADDR-B12: MEM-INT-BUF-2.18(B1) MEMORY-0-8KX8-6264.2(A12) MEMORY-1-8KX8-6264.2(A12) MEMORY-2-8KX8-6264.2(A12) MEMORY-3-8KX8-6264.2(A12)
ADDR-BUS0: 74LS161N-0.14(QA) ADDR-R/P-SW-0.2(1A) PC-BUF-L.2(A1)
ADDR-BUS1: 74LS161N-0.13(QB) ADDR-R/P-SW-0.5(2A) PC-BUF-L.3(A2)
ADDR-BUS2: 74LS161N-0.12(QC) ADDR-R/P-SW-0.11(3A) PC-BUF-L.4(A3)
ADDR-BUS3: 74LS161N-0.11(QD) ADDR-R/P-SW-0.14(4A) PC-BUF-L.5(A4)
ADDR-BUS4: 74LS161N-1.14(QA) 74LS161N-2.14(QA) ADDR-R/P-SW-1.2(1A) PC-BUF-H.2(A1) PC-BUF-L.6(A5)
ADDR-BUS5: 74LS161N-1.13(QB) 74LS161N-2.13(QB) ADDR-R/P-SW-1.5(2A) PC-BUF-H.3(A2) PC-BUF-L.7(A6)
ADDR-BUS6: 74LS161N-1.12(QC) 74LS161N-2.12(QC) ADDR-R/P-SW-1.11(3A) PC-BUF-H.4(A3) PC-BUF-L.8(A7)
ADDR-BUS7: 74LS161N-1.11(QD) 74LS161N-2.11(QD) ADDR-R/P-SW-1.14(4A) PC-BUF-H.5(A4) PC-BUF-L.9(A8)
ADDR-BUS12: 74LS161N-3.3(A) ADDR-R/P-SW-3.2(1A) CHIP-SELECT-REG-0.5(Q3)
ADDR-EX: 74LS161N-3.14(QA)
ADDR-PAGE8: ADDR-R/P-SW-2.2(1A)
ADDR-PAGE9: ADDR-R/P-SW-2.5(2A)
ADDR-PAGE10: ADDR-R/P-SW-2.11(3A)
ADDR-PAGE11: ADDR-R/P-SW-2.14(4A)
ADDR-PROG0: ADDR-R/P-SW-0.3(1B) PROG/RUN-ADDR-SW.1
ADDR-PROG1: ADDR-R/P-SW-0.6(2B) PROG/RUN-ADDR-SW.2
ADDR-PROG2: ADDR-R/P-SW-0.10(3B) PROG/RUN-ADDR-SW.3
ADDR-PROG3: ADDR-R/P-SW-0.13(4B) PROG/RUN-ADDR-SW.4
ADDR-PROG4: ADDR-R/P-SW-1.3(1B) PROG/RUN-ADDR-SW.5
ADDR-PROG5: ADDR-R/P-SW-1.6(2B) PROG/RUN-ADDR-SW.6
ADDR-PROG6: ADDR-R/P-SW-1.10(3B) PROG/RUN-ADDR-SW.7
ADDR-PROG7: ADDR-R/P-SW-1.13(4B) PROG/RUN-ADDR-SW.8
ADDR-PROG8: ADDR-R/P-SW-2.3(1B) PROG/RUN-ADDR-SW.9
ADDR-PROG9: ADDR-R/P-SW-2.6(2B) PROG/RUN-ADDR-SW.10
ADDR-PROG10: ADDR-R/P-SW-2.10(3B) PROG/RUN-ADDR-SW.11
ADDR-PROG11: ADDR-R/P-SW-2.13(4B) PROG/RUN-ADDR-SW.12
ADDR-PROG12: ADDR-R/P-SW-3.3(1B) SW3.1
ALU-A: AT28C16-1.10(D1) DUAL-4X1-MUX-0.14(A) DUAL-4X1-MUX-1.14(A) DUAL-4X1-MUX-2.14(A) DUAL-4X1-MUX-3.14(A)
ALU-B: AT28C16-1.11(D2) DUAL-4X1-MUX-0.2(B) DUAL-4X1-MUX-1.2(B) DUAL-4X1-MUX-2.2(B) DUAL-4X1-MUX-3.2(B)
ALU-C: 4BIT-FULL-ADDER-2.7(C0) AT28C16-1.13(D3) IC46.1(A:I0) IC46.4(B:I0) IC46.9(C:I0) IC46.12(D:I0) IC47.1(A:I0) IC47.4(B:I0) IC47.9(C:I0) IC47.12(D:I0)
ALU-C0-OUT: ALU-BUF.2(A1) DUAL-4X1-MUX-0.7(1Y)
ALU-C1-OUT: ALU-BUF.3(A2) DUAL-4X1-MUX-0.9(2Y)
ALU-C2-OUT: ALU-BUF.4(A3) DUAL-4X1-MUX-1.7(1Y)
ALU-C3-OUT: ALU-BUF.5(A4) DUAL-4X1-MUX-1.9(2Y)
ALU-C4-OUT: ALU-BUF.6(A5) DUAL-4X1-MUX-2.7(1Y)
ALU-C5-OUT: ALU-BUF.7(A6) DUAL-4X1-MUX-2.9(2Y)
ALU-C6-OUT: ALU-BUF.8(A7) DUAL-4X1-MUX-3.7(1Y)
ALU-C7-OUT: ALU-BUF.9(A8) DUAL-4X1-MUX-3.9(2Y)
ALU-EO: REG-ACU-BUF1.19(G)
ALU-O: ALU-BUF.19(G) AT28C16-1.9(D0)
CARRY-1: 4BIT-FULL-ADDER-3.9(C4)
CEN-A0: DEMUX-2X4-0.4(A:Y0) LED12.A MEM-INT-BUF-0.2(A1)
CEN-A1: DEMUX-2X4-0.5(A:Y1) LED13.A MEM-INT-BUF-0.3(A2)
CEN-A2: DEMUX-2X4-0.6(A:Y2) LED14.A MEM-INT-BUF-0.4(A3)
CEN-A3: DEMUX-2X4-0.7(A:Y3) LED15.A MEM-INT-BUF-0.5(A4)
CEN-B0: MEM-INT-BUF-0.18(B1) MEMORY-0-8KX8-6264.20(!CS1)
CEN-B1: MEM-INT-BUF-0.17(B2) MEMORY-1-8KX8-6264.20(!CS1)
CEN-B2: MEM-INT-BUF-0.16(B3) MEMORY-2-8KX8-6264.20(!CS1)
CEN-B3: MEM-INT-BUF-0.15(B4) MEMORY-3-8KX8-6264.20(!CS1)
CF: AT28C16-0.4(A4) AT28C16-1.4(A4) AT28C16-2.4(A4) AT28C16-3.4(A4)
CLK-CV: C1.2 CLK.5(CV)
CLK-DIS: CLK.7(DIS) Q1.C R3.1
CLK-SIG: 74LS161N-0.2(CLK) 74LS161N-1.2(CLK) 74LS161N-2.2(CLK) 74LS161N-3.2(CLK) 74LS161N.2(CLK) CHIP-SELECT-REG-0.7(CLK) IC10.1(A:I) IC10.2(A:O) LED1.K(C) PAGE-ADDR-REG-0.7(CLK) REG-ACU-H.7(CLK) REG-ACU-L.7(CLK) REG-IO0-H.7(CLK) REG-IO0-L.7(CLK) REG-IO1-H.7(CLK) REG-IO1-L.7(CLK) REG-IO2-H.7(CLK) REG-IO2-L.7(CLK) REG-IO3-H.7(CLK) REG-IO3-L.7(CLK) REG-IR-H.7(CLK) REG-IR-L.7(CLK) REG-MAR-H.7(CLK) REG-MAR-L.7(CLK) REG-MBR-H.7(CLK) REG-MBR-L.7(CLK)
CLK-TR-THR: C2.+ CLK.2(TR) CLK.6(THR) Q1.B R2.2(S) R6.1 R6.2 S2.1(S)
CMD0: AT28C16-0.1(A7) AT28C16-1.1(A7) AT28C16-2.1(A7) AT28C16-3.1(A7)
CMD1: AT28C16-0.23(A8) AT28C16-1.23(A8) AT28C16-2.23(A8) AT28C16-3.23(A8)
CMD2: AT28C16-0.22(A9) AT28C16-1.22(A9) AT28C16-2.22(A9) AT28C16-3.22(A9)
CMD3: AT28C16-0.19(A10) AT28C16-1.19(A10) AT28C16-2.19(A10) AT28C16-3.19(A10)
COUNTER-CARRY-0: 74LS161N-0.15(RCO) 74LS161N-1.10(ENT)
COUNTER-CARRY-1: 74LS161N-1.15(RCO) 74LS161N-2.10(ENT)
COUNTER-CARRY-2: 74LS161N-2.15(RCO) 74LS161N-3.10(ENT)
CS0: CHIP-SELECT-REG-0.3(Q1) DEMUX-2X4-0.2(A:A)
CS1: CHIP-SELECT-REG-0.4(Q2) DEMUX-2X4-0.3(A:B)
CS-I: AT28C16-3.14(D4) CHIP-SELECT-REG-0.9(G1) CHIP-SELECT-REG-0.10(G2)
DATA-B0: LED25.A MEM-BUF.2(A1) MEMORY-0-8KX8-6264.11(I/O1) MEMORY-1-8KX8-6264.11(I/O1) MEMORY-2-8KX8-6264.11(I/O1) MEMORY-3-8KX8-6264.11(I/O1)
DATA-B1: LED24.A MEM-BUF.3(A2) MEMORY-0-8KX8-6264.12(I/O2) MEMORY-1-8KX8-6264.12(I/O2) MEMORY-2-8KX8-6264.12(I/O2) MEMORY-3-8KX8-6264.12(I/O2)
DATA-B2: LED23.A MEM-BUF.4(A3) MEMORY-0-8KX8-6264.13(I/O3) MEMORY-1-8KX8-6264.13(I/O3) MEMORY-2-8KX8-6264.13(I/O3) MEMORY-3-8KX8-6264.13(I/O3)
DATA-B3: LED22.A MEM-BUF.5(A4) MEMORY-0-8KX8-6264.15(I/O4) MEMORY-1-8KX8-6264.15(I/O4) MEMORY-2-8KX8-6264.15(I/O4) MEMORY-3-8KX8-6264.15(I/O4)
DATA-B4: LED21.A MEM-BUF.6(A5) MEMORY-0-8KX8-6264.16(I/O5) MEMORY-1-8KX8-6264.16(I/O5) MEMORY-2-8KX8-6264.16(I/O5) MEMORY-3-8KX8-6264.16(I/O5)
DATA-B5: LED20.A MEM-BUF.7(A6) MEMORY-0-8KX8-6264.17(I/O6) MEMORY-1-8KX8-6264.17(I/O6) MEMORY-2-8KX8-6264.17(I/O6) MEMORY-3-8KX8-6264.17(I/O6)
DATA-B6: LED19.A MEM-BUF.8(A7) MEMORY-0-8KX8-6264.18(I/O7) MEMORY-1-8KX8-6264.18(I/O7) MEMORY-2-8KX8-6264.18(I/O7) MEMORY-3-8KX8-6264.18(I/O7)
DATA-B7: LED18.A MEM-BUF.9(A8) MEMORY-0-8KX8-6264.19(I/O8) MEMORY-1-8KX8-6264.19(I/O8) MEMORY-2-8KX8-6264.19(I/O8) MEMORY-3-8KX8-6264.19(I/O8)
DATA-BUS0: 74LS161N-0.3(A) ALU-BUF.18(B1) CHIP-SELECT-REG-0.14(D1) DATA-R/P-SW-0.2(1A) DATA-R/P-SW-0.4(1Y) MEM-BUF.18(B1) PC-BUF-L.18(B1) REG-ACU-BUF0.18(B1) REG-ACU-L.14(D1) REG-IO0-BUF.18(B1) REG-IO0-L.14(D1) REG-IO1-BUF.18(B1) REG-IO1-L.14(D1) REG-IO2-BUF.18(B1) REG-IO2-L.14(D1) REG-IO3-BUF.18(B1) REG-IO3-L.14(D1) REG-IR-BUF.18(B1) REG-IR-L.14(D1) REG-MAR-BUF.18(B1) REG-MAR-L.14(D1) REG-MBR-BUF0.18(B1) REG-MBR-L.14(D1)
DATA-BUS1: 74LS161N-0.4(B) ALU-BUF.17(B2) CHIP-SELECT-REG-0.13(D2) DATA-R/P-SW-0.5(2A) DATA-R/P-SW-0.7(2Y) MEM-BUF.17(B2) PC-BUF-L.17(B2) REG-ACU-BUF0.17(B2) REG-ACU-L.13(D2) REG-IO0-BUF.17(B2) REG-IO0-L.13(D2) REG-IO1-BUF.17(B2) REG-IO1-L.13(D2) REG-IO2-BUF.17(B2) REG-IO2-L.13(D2) REG-IO3-BUF.17(B2) REG-IO3-L.13(D2) REG-IR-BUF.17(B2) REG-IR-L.13(D2) REG-MAR-BUF.17(B2) REG-MAR-L.13(D2) REG-MBR-BUF0.17(B2) REG-MBR-L.13(D2)
DATA-BUS2: 74LS161N-0.5(C) ALU-BUF.16(B3) CHIP-SELECT-REG-0.12(D3) DATA-R/P-SW-0.9(3Y) DATA-R/P-SW-0.11(3A) MEM-BUF.16(B3) PC-BUF-L.16(B3) REG-ACU-BUF0.16(B3) REG-ACU-L.12(D3) REG-IO0-BUF.16(B3) REG-IO0-L.12(D3) REG-IO1-BUF.16(B3) REG-IO1-L.12(D3) REG-IO2-BUF.16(B3) REG-IO2-L.12(D3) REG-IO3-BUF.16(B3) REG-IO3-L.12(D3) REG-IR-BUF.16(B3) REG-IR-L.12(D3) REG-MAR-BUF.16(B3) REG-MAR-L.12(D3) REG-MBR-BUF0.16(B3) REG-MBR-L.12(D3)
DATA-BUS3: 74LS161N-0.6(D) ALU-BUF.15(B4) CHIP-SELECT-REG-0.11(D4) DATA-R/P-SW-0.12(4Y) DATA-R/P-SW-0.14(4A) MEM-BUF.15(B4) PC-BUF-L.15(B4) REG-ACU-BUF0.15(B4) REG-ACU-L.11(D4) REG-IO0-BUF.15(B4) REG-IO0-L.11(D4) REG-IO1-BUF.15(B4) REG-IO1-L.11(D4) REG-IO2-BUF.15(B4) REG-IO2-L.11(D4) REG-IO3-BUF.15(B4) REG-IO3-L.11(D4) REG-IR-BUF.15(B4) REG-IR-L.11(D4) REG-MAR-BUF.15(B4) REG-MAR-L.11(D4) REG-MBR-BUF0.15(B4) REG-MBR-L.11(D4)
DATA-BUS4: 74LS161N-1.3(A) 74LS161N-2.3(A) ALU-BUF.14(B5) DATA-R/P-SW-1.2(1A) DATA-R/P-SW-1.4(1Y) MEM-BUF.14(B5) PAGE-ADDR-REG-0.3(Q1) PAGE-ADDR-REG-0.14(D1) PC-BUF-H.18(B1) PC-BUF-L.14(B5) REG-ACU-BUF0.14(B5) REG-ACU-H.14(D1) REG-IO0-BUF.14(B5) REG-IO0-H.14(D1) REG-IO1-BUF.14(B5) REG-IO1-H.14(D1) REG-IO2-BUF.14(B5) REG-IO2-H.14(D1) REG-IO3-BUF.14(B5) REG-IO3-H.14(D1) REG-IR-H.14(D1) REG-MAR-BUF.14(B5) REG-MAR-H.14(D1) REG-MBR-BUF0.14(B5) REG-MBR-H.14(D1)
DATA-BUS5: 74LS161N-1.4(B) 74LS161N-2.4(B) ALU-BUF.13(B6) DATA-R/P-SW-1.5(2A) DATA-R/P-SW-1.7(2Y) MEM-BUF.13(B6) PAGE-ADDR-REG-0.4(Q2) PAGE-ADDR-REG-0.13(D2) PC-BUF-H.17(B2) PC-BUF-L.13(B6) REG-ACU-BUF0.13(B6) REG-ACU-H.13(D2) REG-IO0-BUF.13(B6) REG-IO0-H.13(D2) REG-IO1-BUF.13(B6) REG-IO1-H.13(D2) REG-IO2-BUF.13(B6) REG-IO2-H.13(D2) REG-IO3-BUF.13(B6) REG-IO3-H.13(D2) REG-IR-H.13(D2) REG-MAR-BUF.13(B6) REG-MAR-H.13(D2) REG-MBR-BUF0.13(B6) REG-MBR-H.13(D2)
DATA-BUS6: 74LS161N-1.5(C) 74LS161N-2.5(C) ALU-BUF.12(B7) DATA-R/P-SW-1.9(3Y) DATA-R/P-SW-1.11(3A) MEM-BUF.12(B7) PAGE-ADDR-REG-0.5(Q3) PAGE-ADDR-REG-0.12(D3) PC-BUF-H.16(B3) PC-BUF-L.12(B7) REG-ACU-BUF0.12(B7) REG-ACU-H.12(D3) REG-IO0-BUF.12(B7) REG-IO0-H.12(D3) REG-IO1-BUF.12(B7) REG-IO1-H.12(D3) REG-IO2-BUF.12(B7) REG-IO2-H.12(D3) REG-IO3-BUF.12(B7) REG-IO3-H.12(D3) REG-IR-H.12(D3) REG-MAR-BUF.12(B7) REG-MAR-H.12(D3) REG-MBR-BUF0.12(B7) REG-MBR-H.12(D3)
DATA-BUS7: 74LS161N-1.6(D) 74LS161N-2.6(D) ALU-BUF.11(B8) DATA-R/P-SW-1.12(4Y) DATA-R/P-SW-1.14(4A) MEM-BUF.11(B8) PAGE-ADDR-REG-0.6(Q4) PAGE-ADDR-REG-0.11(D4) PC-BUF-H.15(B4) PC-BUF-L.11(B8) REG-ACU-BUF0.11(B8) REG-ACU-H.11(D4) REG-IO0-BUF.11(B8) REG-IO0-H.11(D4) REG-IO1-BUF.11(B8) REG-IO1-H.11(D4) REG-IO2-BUF.11(B8) REG-IO2-H.11(D4) REG-IO3-BUF.11(B8) REG-IO3-H.11(D4) REG-IR-H.11(D4) REG-MAR-BUF.11(B8) REG-MAR-H.11(D4) REG-MBR-BUF0.11(B8) REG-MBR-H.11(D4)
DATA-IR0: REG-IR-BUF.14(B5)
DATA-IR1: REG-IR-BUF.13(B6)
DATA-IR2: REG-IR-BUF.12(B7)
DATA-IR3: REG-IR-BUF.11(B8)
DATA-PROG0: DATA-R/P-SW-0.3(1B) PROG/RUN-DATA-SW.1
DATA-PROG1: DATA-R/P-SW-0.6(2B) PROG/RUN-DATA-SW.2
DATA-PROG2: DATA-R/P-SW-0.10(3B) PROG/RUN-DATA-SW.3
DATA-PROG3: DATA-R/P-SW-0.13(4B) PROG/RUN-DATA-SW.4
DATA-PROG4: DATA-R/P-SW-1.3(1B) PROG/RUN-DATA-SW.5
DATA-PROG5: DATA-R/P-SW-1.6(2B) PROG/RUN-DATA-SW.6
DATA-PROG6: DATA-R/P-SW-1.10(3B) PROG/RUN-DATA-SW.7
DATA-PROG7: DATA-R/P-SW-1.13(4B) PROG/RUN-DATA-SW.8
DISP-CLK: JK-FLIP-FLOP.1(A:CLK) SEG-SWITCH.3(Q)
DISP-DATA-IN0: EEPROM-AT28C16.8(A0)
DISP-DATA-IN1: EEPROM-AT28C16.7(A1)
DISP-DATA-IN2: EEPROM-AT28C16.6(A2)
DISP-DATA-IN3: EEPROM-AT28C16.5(A3)
DISP-DATA-IN4: EEPROM-AT28C16.4(A4)
DISP-DATA-IN5: EEPROM-AT28C16.3(A5)
DISP-DATA-IN6: EEPROM-AT28C16.2(A6)
DISP-DATA-IN7: EEPROM-AT28C16.1(A7)
DISP-DATA-OUT0: EEPROM-AT28C16.9(D0) SEG-DISP0.7(A) SEG-DISP1.7(A) SEG-DISP2.7(A) SEG-DISP3.7(A)
DISP-DATA-OUT1: EEPROM-AT28C16.10(D1) SEG-DISP0.6(B) SEG-DISP1.6(B) SEG-DISP2.6(B) SEG-DISP3.6(B)
DISP-DATA-OUT2: EEPROM-AT28C16.11(D2) SEG-DISP0.4(C) SEG-DISP1.4(C) SEG-DISP2.4(C) SEG-DISP3.4(C)
DISP-DATA-OUT3: EEPROM-AT28C16.13(D3) SEG-DISP0.2(D) SEG-DISP1.2(D) SEG-DISP2.2(D) SEG-DISP3.2(D)
DISP-DATA-OUT4: EEPROM-AT28C16.14(D4) SEG-DISP0.1(E) SEG-DISP1.1(E) SEG-DISP2.1(E) SEG-DISP3.1(E)
DISP-DATA-OUT5: EEPROM-AT28C16.15(D5) SEG-DISP0.9(F) SEG-DISP1.9(F) SEG-DISP2.9(F) SEG-DISP3.9(F)
DISP-DATA-OUT6: EEPROM-AT28C16.16(D6) SEG-DISP0.10(G) SEG-DISP1.10(G) SEG-DISP2.10(G) SEG-DISP3.10(G)
DISP-DATA-OUT7: EEPROM-AT28C16.17(D7) SEG-DISP0.5(DP) SEG-DISP1.5(DP) SEG-DISP2.5(DP) SEG-DISP3.5(DP)
DISP-EN0: IC12.4(A:Y0) SEG-DISP0.3(CK1) SEG-DISP0.8(CK2)
DISP-EN1: IC12.5(A:Y1) SEG-DISP1.3(CK1) SEG-DISP1.8(CK2)
DISP-EN2: IC12.6(A:Y2) SEG-DISP2.3(CK1) SEG-DISP2.8(CK2)
DISP-EN3: IC12.7(A:Y3) SEG-DISP3.3(CK1) SEG-DISP3.8(CK2)
DISP-FF-OUT0: EEPROM-AT28C16.23(A8) IC12.2(A:A) JK-FLIP-FLOP.6(B:CLK) JK-FLIP-FLOP.15(A:Q)
DISP-FF-OUT1: EEPROM-AT28C16.22(A9) IC12.3(A:B) JK-FLIP-FLOP.11(B:Q)
DISP-NEG-SWITCH: EEPROM-AT28C16.19(A10)
DISP-TRIG: C4.2 R8.2 R9.2 SEG-SWITCH.2(TR) SEG-SWITCH.6(THR)
FLAG-I: AT28C16-3.15(D5)
GND: 74LS161N-3.4(B) 74LS161N-3.5(C) 74LS161N-3.6(D) 74LS161N-3.11(QD) 74LS161N-3.12(QC) 74LS161N-3.15(RCO) 74LS161N.3(A) 74LS161N.4(B) 74LS161N.5(C) 74LS161N.6(D) 74LS161N.15(RCO) ADDR-R/P-SW-0.15(G) ADDR-R/P-SW-1.15(G) ADDR-R/P-SW-2.15(G) ADDR-R/P-SW-3.5(2A) ADDR-R/P-SW-3.6(2B) ADDR-R/P-SW-3.7(2Y) ADDR-R/P-SW-3.9(3Y) ADDR-R/P-SW-3.10(3B) ADDR-R/P-SW-3.11(3A) ADDR-R/P-SW-3.12(4Y) ADDR-R/P-SW-3.13(4B) ADDR-R/P-SW-3.14(4A) ADDR-R/P-SW-3.15(G) AT28C16-0.18(!CE) AT28C16-0.20(!OE) AT28C16-1.18(!CE) AT28C16-1.20(!OE) AT28C16-2.18(!CE) AT28C16-2.20(!OE) AT28C16-3.16(D6) AT28C16-3.17(D7) AT28C16-3.18(!CE) AT28C16-3.20(!OE) C1.1 C2.- C3.2 C4.1 CHIP-SELECT-REG-0.1(M) CHIP-SELECT-REG-0.2(N) CHIP-SELECT-REG-0.6(Q4) CHIP-SELECT-REG-0.15(CLR) CLK.1(GND) CLK.4(R) DATA-R/P-SW-0.15(G) DATA-R/P-SW-1.15(G) DUAL-4X1-MUX-0.1(1G) DUAL-4X1-MUX-0.15(2G) DUAL-4X1-MUX-1.1(1G) DUAL-4X1-MUX-1.15(2G) DUAL-4X1-MUX-2.1(1G) DUAL-4X1-MUX-2.15(2G) DUAL-4X1-MUX-3.1(1G) DUAL-4X1-MUX-3.15(2G) EEPROM-AT28C16.18(!CE) EEPROM-AT28C16.20(!OE) IC11.13 IC11.14 IC11.15 IC11.16 IC11.17 IC11.18(G1) IC11.19(G2) IC12.1(A:G) JK-FLIP-FLOP.10(B:!Q) JK-FLIP-FLOP.12(B:K) JK-FLIP-FLOP.14(A:!Q) LED0.K(C) LED2.K(C) LED3.K(C) LED4.K(C) LED5.K(C) LED6.K(C) LED7.K(C) LED8.K(C) LED9.K(C) LED10.K(C) LED11.K(C) LED12.K(C) LED13.K(C) LED14.K(C) LED15.K(C) LED16.K(C) LED17.K(C) LED18.K(C) LED19.K(C) LED20.K(C) LED21.K(C) LED22.K(C) LED23.K(C) LED24.K(C) LED25.K(C) LED26.K(C) LED27.K(C) LED28.K(C) LED29.K(C) LED30.K(C) LED31.K(C) LED32.K(C) LED33.K(C) LED34.K(C) LED35.K(C) LED36.K(C) LED37.K(C) LED38.K(C) LED39.K(C) LED40.K(C) LED41.K(C) LED42.K(C) LED43.K(C) LED44.K(C) LED45.K(C) LED46.K(C) LED47.K(C) LED48.K(C) LED49.K(C) LED50.K(C) LED51.K(C) LED52.K(C) LED53.K(C) LED54.K(C) LED55.K(C) LED56.K(C) LED57.K(C) LED58.K(C) LED59.K(C) LED60.K(C) LED61.K(C) LED62.K(C) LED63.K(C) LED64.K(C) LED65.K(C) LED66.K(C) LED67.K(C) LED68.K(C) LED69.K(C) LED70.K(C) LED71.K(C) LED72.K(C) LED73.K(C) LED74.K(C) LED75.K(C) LED76.K(C) LED77.K(C) LED78.K(C) LED79.K(C) LED80.K(C) LED81.K(C) LED82.K(C) LED83.K(C) LED84.K(C) LED85.K(C) LED86.K(C) LED87.K(C) LED88.K(C) LED89.K(C) LED90.K(C) LED91.K(C) LED92.K(C) LED93.K(C) LED94.K(C) LED95.K(C) LED96.K(C) LED97.K(C) LED98.K(C) LED99.K(C) MEM-INT-BUF-0.19(G) MEM-INT-BUF-1.19(G) MEM-INT-BUF-2.3(A2) MEM-INT-BUF-2.4(A3) MEM-INT-BUF-2.5(A4) MEM-INT-BUF-2.6(A5) MEM-INT-BUF-2.7(A6) MEM-INT-BUF-2.8(A7) MEM-INT-BUF-2.9(A8) MEM-INT-BUF-2.11(B8) MEM-INT-BUF-2.12(B7) MEM-INT-BUF-2.13(B6) MEM-INT-BUF-2.14(B5) MEM-INT-BUF-2.15(B4) MEM-INT-BUF-2.16(B3) MEM-INT-BUF-2.17(B2) MEM-INT-BUF-2.19(G) MEMORY-0-8KX8-6264.14(VSS) MEMORY-1-8KX8-6264.14(VSS) MEMORY-2-8KX8-6264.14(VSS) MEMORY-3-8KX8-6264.14(VSS) PAGE-ADDR-REG-0.1(M) PAGE-ADDR-REG-0.2(N) PAGE-ADDR-REG-0.15(CLR) PC-BUF-H.6(A5) PC-BUF-H.7(A6) PC-BUF-H.8(A7) PC-BUF-H.9(A8) PC-BUF-H.11(B8) PC-BUF-H.12(B7) PC-BUF-H.13(B6) PC-BUF-H.14(B5) PROG/RUN-ADDR-SW.13 PROG/RUN-ADDR-SW.14 PROG/RUN-ADDR-SW.15 PROG/RUN-ADDR-SW.16 PROG/RUN-ADDR-SW.17 PROG/RUN-ADDR-SW.18 PROG/RUN-ADDR-SW.19 PROG/RUN-ADDR-SW.20 PROG/RUN-ADDR-SW.21 PROG/RUN-ADDR-SW.22 PROG/RUN-ADDR-SW.23 PROG/RUN-ADDR-SW.24 PROG/RUN-DATA-SW.9 PROG/RUN-DATA-SW.10 PROG/RUN-DATA-SW.11 PROG/RUN-DATA-SW.12 PROG/RUN-DATA-SW.13 PROG/RUN-DATA-SW.14 PROG/RUN-DATA-SW.15 PROG/RUN-DATA-SW.16 R2.1(A) R4.1 REG-ACU-H.1(M) REG-ACU-H.2(N) REG-ACU-L.1(M) REG-ACU-L.2(N) REG-IO0-H.1(M) REG-IO0-H.2(N) REG-IO0-L.1(M) REG-IO0-L.2(N) REG-IO1-H.1(M) REG-IO1-H.2(N) REG-IO1-L.1(M) REG-IO1-L.2(N) REG-IO2-H.1(M) REG-IO2-H.2(N) REG-IO2-L.1(M) REG-IO2-L.2(N) REG-IO3-H.1(M) REG-IO3-H.2(N) REG-IO3-L.1(M) REG-IO3-L.2(N) REG-IR-H.1(M) REG-IR-H.2(N) REG-IR-L.1(M) REG-IR-L.2(N) REG-MAR-H.1(M) REG-MAR-H.2(N) REG-MAR-L.1(M) REG-MAR-L.2(N) REG-MBR-H.1(M) REG-MBR-H.2(N) REG-MBR-L.1(M) REG-MBR-L.2(N) S1.1(S) S2.2(P) S2.3(O) S3.2(S1) S3.4(P1) SEG-SWITCH.1(GND) SW2.2 SW3.2
HLT: AT28C16-1.14(D4) Q2.S R7.1
IO0-I: AT28C16-2.10(D1) REG-IO0-H.9(G1) REG-IO0-H.10(G2) REG-IO0-L.9(G1) REG-IO0-L.10(G2)
IO0-O: AT28C16-3.9(D0) REG-IO0-BUF.19(G)
IO1-I: AT28C16-2.11(D2) REG-IO1-H.9(G1) REG-IO1-H.10(G2) REG-IO1-L.9(G1) REG-IO1-L.10(G2)
IO1-O: AT28C16-3.10(D1) REG-IO1-BUF.19(G)
IO2-I: AT28C16-2.13(D3) REG-IO2-H.9(G1) REG-IO2-H.10(G2) REG-IO2-L.9(G1) REG-IO2-L.10(G2)
IO2-O: AT28C16-3.11(D2) REG-IO2-BUF.19(G)
IO3-I: REG-IO3-H.9(G1) REG-IO3-H.10(G2) REG-IO3-L.9(G1) REG-IO3-L.10(G2)
IO3-O: REG-IO3-BUF.19(G)
IR-I: AT28C16-1.17(D7) REG-IR-H.9(G1) REG-IR-H.10(G2) REG-IR-L.9(G1) REG-IR-L.10(G2)
IR-O: AT28C16-2.16(D6) REG-IR-BUF.19(G)
MAR-I: AT28C16-1.16(D6) REG-MAR-H.9(G1) REG-MAR-H.10(G2) REG-MAR-L.9(G1) REG-MAR-L.10(G2)
MAR-O: AT28C16-2.15(D5) REG-MAR-BUF.19(G)
MBR-DATA0: IC35.12(D:I0) IC37.13(D:I1) REG-MBR-BUF1.18(B1)
MBR-DATA1: IC38.2(A:I1) IC39.1(A:I0) REG-MBR-BUF1.17(B2)
MBR-DATA2: IC41.13(D:I1) IC42.12(D:I0) REG-MBR-BUF1.16(B3)
MBR-DATA3: IC44.2(A:I1) IC45.1(A:I0) REG-MBR-BUF1.15(B4)
MBR-DATA4: IC48.12(D:I0) IC50.13(D:I1) REG-MBR-BUF1.14(B5)
MBR-DATA5: IC51.2(A:I1) IC52.1(A:I0) REG-MBR-BUF1.13(B6)
MBR-DATA6: IC54.13(D:I1) IC55.12(D:I0) REG-MBR-BUF1.12(B7)
MBR-DATA7: IC57.2(A:I1) IC58.1(A:I0) REG-MBR-BUF1.11(B8)
MBR-I: AT28C16-2.9(D0) REG-MBR-H.9(G1) REG-MBR-H.10(G2) REG-MBR-L.9(G1) REG-MBR-L.10(G2)
MBR-O: AT28C16-2.17(D7) REG-MBR-BUF0.19(G)
MRD: AT28C16-0.15(D5) MEMORY-0-8KX8-6264.22(!OE) MEMORY-1-8KX8-6264.22(!OE) MEMORY-2-8KX8-6264.22(!OE) MEMORY-3-8KX8-6264.22(!OE)
MRQ: AT28C16-0.13(D3) DEMUX-2X4-0.1(A:G) MEM-BUF.19(G)
MUX0-1C0: 4BIT-FULL-ADDER-2.4(S1) DUAL-4X1-MUX-0.6(1C0)
MUX0-1C1: DUAL-4X1-MUX-0.5(1C1) IC35.11(D:O)
MUX0-1C2: DUAL-4X1-MUX-0.4(1C2) IC1.2(A:O)
MUX0-1C3: DUAL-4X1-MUX-0.3(1C3) IC37.11(D:O)
MUX0-2C0: 4BIT-FULL-ADDER-2.1(S2) DUAL-4X1-MUX-0.10(2C0)
MUX0-2C1: DUAL-4X1-MUX-0.11(2C1) IC39.3(A:O)
MUX0-2C2: DUAL-4X1-MUX-0.12(2C2) IC2.2(A:O)
MUX0-2C3: DUAL-4X1-MUX-0.13(2C3) IC38.3(A:O)
MUX1-1C0: 4BIT-FULL-ADDER-2.13(S3) DUAL-4X1-MUX-1.6(1C0)
MUX1-1C1: DUAL-4X1-MUX-1.5(1C1) IC42.11(D:O)
MUX1-1C2: DUAL-4X1-MUX-1.4(1C2) IC3.2(A:O)
MUX1-1C3: DUAL-4X1-MUX-1.3(1C3) IC41.11(D:O)
MUX1-2C0: 4BIT-FULL-ADDER-2.10(S4) DUAL-4X1-MUX-1.10(2C0)
MUX1-2C1: DUAL-4X1-MUX-1.11(2C1)
MUX1-2C1-IN: IC45.3(A:O)
MUX1-2C2: DUAL-4X1-MUX-1.12(2C2)
MUX1-2C2-IN: IC4.2(A:O)
MUX1-2C3: DUAL-4X1-MUX-1.13(2C3)
MUX1-2C3-IN: IC44.3(A:O)
MUX2-1C0: 4BIT-FULL-ADDER-3.4(S1) DUAL-4X1-MUX-2.6(1C0)
MUX2-1C1: DUAL-4X1-MUX-2.5(1C1) IC48.11(D:O)
MUX2-1C2: DUAL-4X1-MUX-2.4(1C2) IC5.2(A:O)
MUX2-1C3: DUAL-4X1-MUX-2.3(1C3) IC50.11(D:O)
MUX2-2C0: 4BIT-FULL-ADDER-3.1(S2) DUAL-4X1-MUX-2.10(2C0)
MUX2-2C1: DUAL-4X1-MUX-2.11(2C1) IC52.3(A:O)
MUX2-2C2: DUAL-4X1-MUX-2.12(2C2) IC6.2(A:O)
MUX2-2C3: DUAL-4X1-MUX-2.13(2C3) IC51.3(A:O)
MUX3-1C0: 4BIT-FULL-ADDER-3.13(S3) DUAL-4X1-MUX-3.6(1C0)
MUX3-1C1: DUAL-4X1-MUX-3.5(1C1) IC55.11(D:O)
MUX3-1C2: DUAL-4X1-MUX-3.4(1C2) IC7.2(A:O)
MUX3-1C3: DUAL-4X1-MUX-3.3(1C3) IC54.11(D:O)
MUX3-2C0: 4BIT-FULL-ADDER-3.10(S4) DUAL-4X1-MUX-3.10(2C0)
MUX3-2C1: DUAL-4X1-MUX-3.11(2C1) IC58.3(A:O)
MUX3-2C2: DUAL-4X1-MUX-3.12(2C2) IC8.2(A:O)
MUX3-2C3: DUAL-4X1-MUX-3.13(2C3) IC57.3(A:O)
MWR: AT28C16-0.14(D4) MEM-BUF.1(DIR) MEMORY-0-8KX8-6264.27(!WE) MEMORY-1-8KX8-6264.27(!WE) MEMORY-2-8KX8-6264.27(!WE) MEMORY-3-8KX8-6264.27(!WE)
N$1: R5.1 S1.3(P)
N$2: R2.3(E) R3.2
N$3: CLK.8(V+) Q1.E R1.1
N$4: IC9.1(A:I0) IC9.2(A:I1) R4.2 S3.1(S)
N$5: 4BIT-FULL-ADDER-2.9(C4) 4BIT-FULL-ADDER-3.7(C0)
N$6: LED1.A Q2.D
N$7: C3.1 SEG-SWITCH.5(CV)
N$8: R8.1 SEG-SWITCH.7(DIS)
N$9: 74LS161N-3.13(QB) RST-INVERTER.1(A:I)
N$10: IC9.8(C:O) IC9.12(D:I0) IC9.13(D:I1)
N$11: IC11.1 LED90.A
N$12: IC11.2 LED91.A
N$13: IC11.3 LED92.A
N$14: IC11.4 LED93.A
N$15: IC11.5 LED94.A
N$16: IC11.6 LED95.A
N$17: IC11.7 LED96.A
N$18: IC11.8 LED97.A
N$19: IC11.9 LED98.A
N$20: IC11.10 LED99.A
PC-EN: 74LS161N-0.7(ENP) 74LS161N-0.10(ENT) 74LS161N-1.7(ENP) 74LS161N-2.7(ENP) 74LS161N-3.7(ENP) AT28C16-0.16(D6)
PC-I: AT28C16-0.17(D7)
PCH-I: 74LS161N-2.9(LD) 74LS161N-3.9(LD)
PCH-O: AT28C16-0.10(D1) PC-BUF-H.19(G)
PCL-I: 74LS161N-0.9(LD) 74LS161N-1.9(LD) AT28C16-3.13(D3)
PCL-O: AT28C16-0.9(D0) PC-BUF-L.19(G)
PR-I: AT28C16-0.11(D2) PAGE-ADDR-REG-0.9(G1) PAGE-ADDR-REG-0.10(G2)
PROG/BUS-SW: ADDR-R/P-SW-0.1(!A!/B) ADDR-R/P-SW-1.1(!A!/B) ADDR-R/P-SW-2.1(!A!/B) ADDR-R/P-SW-3.1(!A!/B) DATA-R/P-SW-0.1(!A!/B) DATA-R/P-SW-1.1(!A!/B) SW2.1
Q: CLK.3(Q) Q2.G R7.2
REG-ACU-DATA0: 4BIT-FULL-ADDER-2.5(A1) LED0.A REG-ACU-BUF0.2(A1) REG-ACU-BUF1.2(A1) REG-ACU-L.3(Q1)
REG-ACU-DATA1: 4BIT-FULL-ADDER-2.3(A2) LED33.A REG-ACU-BUF0.3(A2) REG-ACU-BUF1.3(A2) REG-ACU-L.4(Q2)
REG-ACU-DATA2: 4BIT-FULL-ADDER-2.14(A3) LED32.A REG-ACU-BUF0.4(A3) REG-ACU-BUF1.4(A3) REG-ACU-L.5(Q3)
REG-ACU-DATA3: 4BIT-FULL-ADDER-2.12(A4) LED31.A REG-ACU-BUF0.5(A4) REG-ACU-BUF1.5(A4) REG-ACU-L.6(Q4)
REG-ACU-DATA4: 4BIT-FULL-ADDER-3.5(A1) LED30.A REG-ACU-BUF0.6(A5) REG-ACU-BUF1.6(A5) REG-ACU-H.3(Q1)
REG-ACU-DATA5: 4BIT-FULL-ADDER-3.3(A2) LED29.A REG-ACU-BUF0.7(A6) REG-ACU-BUF1.7(A6) REG-ACU-H.4(Q2)
REG-ACU-DATA6: 4BIT-FULL-ADDER-3.14(A3) LED28.A REG-ACU-BUF0.8(A7) REG-ACU-BUF1.8(A7) REG-ACU-H.5(Q3)
REG-ACU-DATA7: 4BIT-FULL-ADDER-3.12(A4) LED27.A REG-ACU-BUF0.9(A8) REG-ACU-BUF1.9(A8) REG-ACU-H.6(Q4)
REG-IO0-DATA0: LED58.A REG-IO0-BUF.2(A1) REG-IO0-L.3(Q1)
REG-IO0-DATA1: LED59.A REG-IO0-BUF.3(A2) REG-IO0-L.4(Q2)
REG-IO0-DATA2: LED60.A REG-IO0-BUF.4(A3) REG-IO0-L.5(Q3)
REG-IO0-DATA3: LED61.A REG-IO0-BUF.5(A4) REG-IO0-L.6(Q4)
REG-IO0-DATA4: LED62.A REG-IO0-BUF.6(A5) REG-IO0-H.3(Q1)
REG-IO0-DATA5: LED63.A REG-IO0-BUF.7(A6) REG-IO0-H.4(Q2)
REG-IO0-DATA6: LED64.A REG-IO0-BUF.8(A7) REG-IO0-H.5(Q3)
REG-IO0-DATA7: LED65.A REG-IO0-BUF.9(A8) REG-IO0-H.6(Q4)
REG-IO1-DATA0: LED66.A REG-IO1-BUF.2(A1) REG-IO1-L.3(Q1)
REG-IO1-DATA1: LED67.A REG-IO1-BUF.3(A2) REG-IO1-L.4(Q2)
REG-IO1-DATA2: LED68.A REG-IO1-BUF.4(A3) REG-IO1-L.5(Q3)
REG-IO1-DATA3: LED69.A REG-IO1-BUF.5(A4) REG-IO1-L.6(Q4)
REG-IO1-DATA4: LED70.A REG-IO1-BUF.6(A5) REG-IO1-H.3(Q1)
REG-IO1-DATA5: LED71.A REG-IO1-BUF.7(A6) REG-IO1-H.4(Q2)
REG-IO1-DATA6: LED72.A REG-IO1-BUF.8(A7) REG-IO1-H.5(Q3)
REG-IO1-DATA7: LED73.A REG-IO1-BUF.9(A8) REG-IO1-H.6(Q4)
REG-IO2-DATA0: LED74.A REG-IO2-BUF.2(A1) REG-IO2-L.3(Q1)
REG-IO2-DATA1: LED75.A REG-IO2-BUF.3(A2) REG-IO2-L.4(Q2)
REG-IO2-DATA2: LED76.A REG-IO2-BUF.4(A3) REG-IO2-L.5(Q3)
REG-IO2-DATA3: LED77.A REG-IO2-BUF.5(A4) REG-IO2-L.6(Q4)
REG-IO2-DATA4: LED78.A REG-IO2-BUF.6(A5) REG-IO2-H.3(Q1)
REG-IO2-DATA5: LED79.A REG-IO2-BUF.7(A6) REG-IO2-H.4(Q2)
REG-IO2-DATA6: LED80.A REG-IO2-BUF.8(A7) REG-IO2-H.5(Q3)
REG-IO2-DATA7: LED81.A REG-IO2-BUF.9(A8) REG-IO2-H.6(Q4)
REG-IO3-DATA0: LED82.A REG-IO3-BUF.2(A1) REG-IO3-L.3(Q1)
REG-IO3-DATA1: LED83.A REG-IO3-BUF.3(A2) REG-IO3-L.4(Q2)
REG-IO3-DATA2: LED84.A REG-IO3-BUF.4(A3) REG-IO3-L.5(Q3)
REG-IO3-DATA3: LED85.A REG-IO3-BUF.5(A4) REG-IO3-L.6(Q4)
REG-IO3-DATA4: LED86.A REG-IO3-BUF.6(A5) REG-IO3-H.3(Q1)
REG-IO3-DATA5: LED87.A REG-IO3-BUF.7(A6) REG-IO3-H.4(Q2)
REG-IO3-DATA6: LED88.A REG-IO3-BUF.8(A7) REG-IO3-H.5(Q3)
REG-IO3-DATA7: LED89.A REG-IO3-BUF.9(A8) REG-IO3-H.6(Q4)
REG-IR-DATA0: LED50.A REG-IR-BUF.2(A1) REG-IR-L.3(Q1)
REG-IR-DATA1: LED51.A REG-IR-BUF.3(A2) REG-IR-L.4(Q2)
REG-IR-DATA2: LED52.A REG-IR-BUF.4(A3) REG-IR-L.5(Q3)
REG-IR-DATA3: LED53.A REG-IR-BUF.5(A4) REG-IR-L.6(Q4)
REG-IR-DATA4: LED54.A REG-IR-BUF.6(A5) REG-IR-H.3(Q1)
REG-IR-DATA5: LED55.A REG-IR-BUF.7(A6) REG-IR-H.4(Q2)
REG-IR-DATA6: LED56.A REG-IR-BUF.8(A7) REG-IR-H.5(Q3)
REG-IR-DATA7: LED57.A REG-IR-BUF.9(A8) REG-IR-H.6(Q4)
REG-MAR-DATA0: LED42.A REG-MAR-BUF.2(A1) REG-MAR-L.3(Q1)
REG-MAR-DATA1: LED43.A REG-MAR-BUF.3(A2) REG-MAR-L.4(Q2)
REG-MAR-DATA2: LED44.A REG-MAR-BUF.4(A3) REG-MAR-L.5(Q3)
REG-MAR-DATA3: LED45.A REG-MAR-BUF.5(A4) REG-MAR-L.6(Q4)
REG-MAR-DATA4: LED46.A REG-MAR-BUF.6(A5) REG-MAR-H.3(Q1)
REG-MAR-DATA5: LED47.A REG-MAR-BUF.7(A6) REG-MAR-H.4(Q2)
REG-MAR-DATA6: LED48.A REG-MAR-BUF.8(A7) REG-MAR-H.5(Q3)
REG-MAR-DATA7: LED49.A REG-MAR-BUF.9(A8) REG-MAR-H.6(Q4)
REG-MBR-DATA0: IC46.2(A:I1) LED34.A REG-MBR-BUF0.2(A1) REG-MBR-BUF1.2(A1) REG-MBR-L.3(Q1)
REG-MBR-DATA1: IC46.5(B:I1) LED35.A REG-MBR-BUF0.3(A2) REG-MBR-BUF1.3(A2) REG-MBR-L.4(Q2)
REG-MBR-DATA2: IC46.10(C:I1) LED36.A REG-MBR-BUF0.4(A3) REG-MBR-BUF1.4(A3) REG-MBR-L.5(Q3)
REG-MBR-DATA3: IC46.13(D:I1) LED37.A REG-MBR-BUF0.5(A4) REG-MBR-BUF1.5(A4) REG-MBR-L.6(Q4)
REG-MBR-DATA4: IC47.2(A:I1) LED38.A REG-MBR-BUF0.6(A5) REG-MBR-BUF1.6(A5) REG-MBR-H.3(Q1)
REG-MBR-DATA5: IC47.5(B:I1) LED39.A REG-MBR-BUF0.7(A6) REG-MBR-BUF1.7(A6) REG-MBR-H.4(Q2)
REG-MBR-DATA6: IC47.10(C:I1) LED40.A REG-MBR-BUF0.8(A7) REG-MBR-BUF1.8(A7) REG-MBR-H.5(Q3)
REG-MBR-DATA7: IC47.13(D:I1) LED41.A REG-MBR-BUF0.9(A8) REG-MBR-BUF1.9(A8) REG-MBR-H.6(Q4)
RST-H: IC9.6(B:O) REG-ACU-H.15(CLR) REG-ACU-L.15(CLR) REG-IO0-H.15(CLR) REG-IO0-L.15(CLR) REG-IO1-H.15(CLR) REG-IO1-L.15(CLR) REG-IO2-H.15(CLR) REG-IO2-L.15(CLR) REG-IO3-H.15(CLR) REG-IO3-L.15(CLR) REG-IR-H.15(CLR) REG-IR-L.15(CLR) REG-MAR-H.15(CLR) REG-MAR-L.15(CLR) REG-MBR-H.15(CLR) REG-MBR-L.15(CLR)
RST-L: 74LS161N-0.1(CLR) 74LS161N-1.1(CLR) 74LS161N-2.1(CLR) 74LS161N-3.1(CLR) IC9.3(A:O) IC9.4(B:I0) IC9.5(B:I1) IC9.9(C:I0) RST-INVERTER.2(A:O)
RST-USTEP: 74LS161N.1(CLR) IC9.11(D:O) IC11.11
SF: AT28C16-0.3(A5) AT28C16-1.3(A5) AT28C16-2.3(A5) AT28C16-3.3(A5)
USTEP: IC9.10(C:I1)
USTEP-A: 74LS161N.14(QA) AT28C16-0.8(A0) AT28C16-1.8(A0) AT28C16-2.8(A0) AT28C16-3.8(A0) IC11.23(A)
USTEP-B: 74LS161N.13(QB) AT28C16-0.7(A1) AT28C16-1.7(A1) AT28C16-2.7(A1) AT28C16-3.7(A1) IC11.22(B)
USTEP-C: 74LS161N.12(QC) AT28C16-0.6(A2) AT28C16-1.6(A2) AT28C16-2.6(A2) AT28C16-3.6(A2) IC11.21(C)
USTEP-D: 74LS161N.11(QD) AT28C16-0.5(A3) AT28C16-1.5(A3) AT28C16-2.5(A3) AT28C16-3.5(A3) IC11.20(D)
VCC: 74LS161N.7(ENP) 74LS161N.9(LD) 74LS161N.10(ENT) ALU-BUF.1(DIR) AT28C16-0.21(!WE) AT28C16-1.21(!WE) AT28C16-2.21(!WE) AT28C16-3.21(!WE) EEPROM-AT28C16.21(!WE) JK-FLIP-FLOP.2(A:PRE) JK-FLIP-FLOP.3(A:CLR) JK-FLIP-FLOP.4(A:J) JK-FLIP-FLOP.7(B:PRE) JK-FLIP-FLOP.8(B:CLR) JK-FLIP-FLOP.9(B:J) JK-FLIP-FLOP.16(A:K) MEM-INT-BUF-0.1(DIR) MEM-INT-BUF-1.1(DIR) MEM-INT-BUF-2.1(DIR) MEMORY-0-8KX8-6264.26(CS2) MEMORY-0-8KX8-6264.28(VCC) MEMORY-1-8KX8-6264.26(CS2) MEMORY-1-8KX8-6264.28(VCC) MEMORY-2-8KX8-6264.26(CS2) MEMORY-2-8KX8-6264.28(VCC) MEMORY-3-8KX8-6264.26(CS2) MEMORY-3-8KX8-6264.28(VCC) PC-BUF-H.1(DIR) PC-BUF-L.1(DIR) R1.2 R5.2 R9.1 REG-ACU-BUF0.1(DIR) REG-ACU-BUF1.1(DIR) REG-IO0-BUF.1(DIR) REG-IO1-BUF.1(DIR) REG-IO2-BUF.1(DIR) REG-IO3-BUF.1(DIR) REG-IR-BUF.1(DIR) REG-MAR-BUF.1(DIR) REG-MBR-BUF0.1(DIR) REG-MBR-BUF1.1(DIR) S3.3(P) SEG-SWITCH.4(R) SEG-SWITCH.8(V+)
ZF: AT28C16-0.2(A6) AT28C16-1.2(A6) AT28C16-2.2(A6) AT28C16-3.2(A6)
Unconnected: DEMUX-2X4-0.9(B:Y3) DEMUX-2X4-0.10(B:Y2) DEMUX-2X4-0.11(B:Y1) DEMUX-2X4-0.12(B:Y0) DEMUX-2X4-0.13(B:B) DEMUX-2X4-0.14(B:A) DEMUX-2X4-0.15(B:G) IC1.3(B:I) IC1.4(B:O) IC1.5(C:I) IC1.6(C:O) IC1.8(D:O) IC1.9(D:I) IC1.10(E:O) IC1.11(E:I) IC1.12(F:O) IC1.13(F:I) IC2.3(B:I) IC2.4(B:O) IC2.5(C:I) IC2.6(C:O) IC2.8(D:O) IC2.9(D:I) IC2.10(E:O) IC2.11(E:I) IC2.12(F:O) IC2.13(F:I) IC3.3(B:I) IC3.4(B:O) IC3.5(C:I) IC3.6(C:O) IC3.8(D:O) IC3.9(D:I) IC3.10(E:O) IC3.11(E:I) IC3.12(F:O) IC3.13(F:I) IC4.3(B:I) IC4.4(B:O) IC4.5(C:I) IC4.6(C:O) IC4.8(D:O) IC4.9(D:I) IC4.10(E:O) IC4.11(E:I) IC4.12(F:O) IC4.13(F:I) IC5.3(B:I) IC5.4(B:O) IC5.5(C:I) IC5.6(C:O) IC5.8(D:O) IC5.9(D:I) IC5.10(E:O) IC5.11(E:I) IC5.12(F:O) IC5.13(F:I) IC6.3(B:I) IC6.4(B:O) IC6.5(C:I) IC6.6(C:O) IC6.8(D:O) IC6.9(D:I) IC6.10(E:O) IC6.11(E:I) IC6.12(F:O) IC6.13(F:I) IC7.3(B:I) IC7.4(B:O) IC7.5(C:I) IC7.6(C:O) IC7.8(D:O) IC7.9(D:I) IC7.10(E:O) IC7.11(E:I) IC7.12(F:O) IC7.13(F:I) IC8.3(B:I) IC8.4(B:O) IC8.5(C:I) IC8.6(C:O) IC8.8(D:O) IC8.9(D:I) IC8.10(E:O) IC8.11(E:I) IC8.12(F:O) IC8.13(F:I) IC10.3(B:I) IC10.4(B:O) IC10.5(C:I) IC10.6(C:O) IC10.8(D:O) IC10.9(D:I) IC10.10(E:O) IC10.11(E:I) IC10.12(F:O) IC10.13(F:I) IC12.9(B:Y3) IC12.10(B:Y2) IC12.11(B:Y1) IC12.12(B:Y0) IC12.13(B:B) IC12.14(B:A) IC12.15(B:G) IC35.1(A:I0) IC35.2(A:I1) IC35.3(A:O) IC35.4(B:I0) IC35.5(B:I1) IC35.6(B:O) IC35.8(C:O) IC35.9(C:I0) IC35.10(C:I1) IC37.1(A:I0) IC37.2(A:I1) IC37.3(A:O) IC37.4(B:I0) IC37.5(B:I1) IC37.6(B:O) IC37.8(C:O) IC37.9(C:I0) IC37.10(C:I1) IC38.4(B:I0) IC38.5(B:I1) IC38.6(B:O) IC38.8(C:O) IC38.9(C:I0) IC38.10(C:I1) IC38.11(D:O) IC38.12(D:I0) IC38.13(D:I1) IC39.4(B:I0) IC39.5(B:I1) IC39.6(B:O) IC39.8(C:O) IC39.9(C:I0) IC39.10(C:I1) IC39.11(D:O) IC39.12(D:I0) IC39.13(D:I1) IC41.1(A:I0) IC41.2(A:I1) IC41.3(A:O) IC41.4(B:I0) IC41.5(B:I1) IC41.6(B:O) IC41.8(C:O) IC41.9(C:I0) IC41.10(C:I1) IC42.1(A:I0) IC42.2(A:I1) IC42.3(A:O) IC42.4(B:I0) IC42.5(B:I1) IC42.6(B:O) IC42.8(C:O) IC42.9(C:I0) IC42.10(C:I1) IC44.4(B:I0) IC44.5(B:I1) IC44.6(B:O) IC44.8(C:O) IC44.9(C:I0) IC44.10(C:I1) IC44.11(D:O) IC44.12(D:I0) IC44.13(D:I1) IC45.4(B:I0) IC45.5(B:I1) IC45.6(B:O) IC45.8(C:O) IC45.9(C:I0) IC45.10(C:I1) IC45.11(D:O) IC45.12(D:I0) IC45.13(D:I1) IC48.1(A:I0) IC48.2(A:I1) IC48.3(A:O) IC48.4(B:I0) IC48.5(B:I1) IC48.6(B:O) IC48.8(C:O) IC48.9(C:I0) IC48.10(C:I1) IC50.1(A:I0) IC50.2(A:I1) IC50.3(A:O) IC50.4(B:I0) IC50.5(B:I1) IC50.6(B:O) IC50.8(C:O) IC50.9(C:I0) IC50.10(C:I1) IC51.4(B:I0) IC51.5(B:I1) IC51.6(B:O) IC51.8(C:O) IC51.9(C:I0) IC51.10(C:I1) IC51.11(D:O) IC51.12(D:I0) IC51.13(D:I1) IC52.4(B:I0) IC52.5(B:I1) IC52.6(B:O) IC52.8(C:O) IC52.9(C:I0) IC52.10(C:I1) IC52.11(D:O) IC52.12(D:I0) IC52.13(D:I1) IC54.1(A:I0) IC54.2(A:I1) IC54.3(A:O) IC54.4(B:I0) IC54.5(B:I1) IC54.6(B:O) IC54.8(C:O) IC54.9(C:I0) IC54.10(C:I1) IC55.1(A:I0) IC55.2(A:I1) IC55.3(A:O) IC55.4(B:I0) IC55.5(B:I1) IC55.6(B:O) IC55.8(C:O) IC55.9(C:I0) IC55.10(C:I1) IC57.4(B:I0) IC57.5(B:I1) IC57.6(B:O) IC57.8(C:O) IC57.9(C:I0) IC57.10(C:I1) IC57.11(D:O) IC57.12(D:I0) IC57.13(D:I1) IC58.4(B:I0) IC58.5(B:I1) IC58.6(B:O) IC58.8(C:O) IC58.9(C:I0) IC58.10(C:I1) IC58.11(D:O) IC58.12(D:I0) IC58.13(D:I1) MEMORY-0-8KX8-6264.1(NC) MEMORY-1-8KX8-6264.1(NC) MEMORY-2-8KX8-6264.1(NC) MEMORY-3-8KX8-6264.1(NC) REG-MBR-BUF1.19(G) RST-INVERTER.3(B:I) RST-INVERTER.4(B:O) RST-INVERTER.5(C:I) RST-INVERTER.6(C:O) RST-INVERTER.8(D:O) RST-INVERTER.9(D:I) RST-INVERTER.10(E:O) RST-INVERTER.11(E:I) RST-INVERTER.12(F:O) RST-INVERTER.13(F:I) S1.2(S1) S1.4(P1)

## Buses
MUX0-1C[0..7],MUX0-2C[0..7],MUX1-1C[0..7],MUX1-2C[0..7]
MUX2-1C[0..3],MUX2-2C[0..3],MUX3-1C[0..3],MUX3-2C[0..3]
ADDR-B[0..12],MEM-EN-B[0..3]
DATA-B[0..7]
ADDR-A[0..12]
ADDR-PROG[0..12]
DATA-P[0..7]
DATA[0..7]
DISP-EN[0..3]
ADDR-BUS[0..12]
REG-ACU-DATA[0..7]
DATA-BUS[0..7]
REG-MBR-DATA[0..7]
REG-MAR-DATA[0..7]
REG-IR-DATA[0..7]
REG-IO0-DATA[0..7]
REG-IO1-DATA[0..7]
REG-IO2-DATA[0..7]
REG-IO3-DATA[0..7]
CF,CMD[0..3],SF,USTEP-A,USTEP-B,USTEP-C,USTEP-D,ZF

## Notes on the sheet
- 8-BIT COMPUTER
- MAIN CLK | GENERAL PURPOSE REGISTERS
- SRAM (STATIC RANDOM ACCESS MEMORY) 4x8K
- ALU (ARITHMETIC LOGIC UNIT)
- NUMERICAL DISPLAY | RESET CIRCUIT
- CONTROL UNIT
- PROGRAM COUNTER

## Power pins joined to a net without a drawn wire
GND: 4BIT-FULL-ADDER-2.8(GND) 4BIT-FULL-ADDER-3.8(GND) 74LS161N-0.8(GND) 74LS161N-1.8(GND) 74LS161N-2.8(GND) 74LS161N-3.8(GND) 74LS161N.8(GND) ADDR-R/P-SW-0.8(GND) ADDR-R/P-SW-1.8(GND) ADDR-R/P-SW-2.8(GND) ADDR-R/P-SW-3.8(GND) ALU-BUF.10(GND) AT28C16-0.12(GND) AT28C16-1.12(GND) AT28C16-2.12(GND) AT28C16-3.12(GND) CHIP-SELECT-REG-0.8(GND) DATA-R/P-SW-0.8(GND) DATA-R/P-SW-1.8(GND) DEMUX-2X4-0.8(P:GND) DUAL-4X1-MUX-0.8(GND) DUAL-4X1-MUX-1.8(GND) DUAL-4X1-MUX-2.8(GND) DUAL-4X1-MUX-3.8(GND) EEPROM-AT28C16.12(GND) IC1.7(P:GND) IC2.7(P:GND) IC3.7(P:GND) IC4.7(P:GND) IC5.7(P:GND) IC6.7(P:GND) IC7.7(P:GND) IC8.7(P:GND) IC9.7(P:GND) IC10.7(P:GND) IC11.12(GND) IC12.8(P:GND) IC35.7(P:GND) IC37.7(P:GND) IC38.7(P:GND) IC39.7(P:GND) IC41.7(P:GND) IC42.7(P:GND) IC44.7(P:GND) IC45.7(P:GND) IC46.7(P:GND) IC47.7(P:GND) IC48.7(P:GND) IC50.7(P:GND) IC51.7(P:GND) IC52.7(P:GND) IC54.7(P:GND) IC55.7(P:GND) IC57.7(P:GND) IC58.7(P:GND) JK-FLIP-FLOP.13(P:GND) MEM-BUF.10(GND) MEM-INT-BUF-0.10(GND) MEM-INT-BUF-1.10(GND) MEM-INT-BUF-2.10(GND) PAGE-ADDR-REG-0.8(GND) PC-BUF-H.10(GND) PC-BUF-L.10(GND) REG-ACU-BUF0.10(GND) REG-ACU-BUF1.10(GND) REG-ACU-H.8(GND) REG-ACU-L.8(GND) REG-IO0-BUF.10(GND) REG-IO0-H.8(GND) REG-IO0-L.8(GND) REG-IO1-BUF.10(GND) REG-IO1-H.8(GND) REG-IO1-L.8(GND) REG-IO2-BUF.10(GND) REG-IO2-H.8(GND) REG-IO2-L.8(GND) REG-IO3-BUF.10(GND) REG-IO3-H.8(GND) REG-IO3-L.8(GND) REG-IR-BUF.10(GND) REG-IR-H.8(GND) REG-IR-L.8(GND) REG-MAR-BUF.10(GND) REG-MAR-H.8(GND) REG-MAR-L.8(GND) REG-MBR-BUF0.10(GND) REG-MBR-BUF1.10(GND) REG-MBR-H.8(GND) REG-MBR-L.8(GND) RST-INVERTER.7(P:GND)
VCC: 4BIT-FULL-ADDER-2.16(VCC) 4BIT-FULL-ADDER-3.16(VCC) 74LS161N-0.16(VCC) 74LS161N-1.16(VCC) 74LS161N-2.16(VCC) 74LS161N-3.16(VCC) 74LS161N.16(VCC) ADDR-R/P-SW-0.16(VCC) ADDR-R/P-SW-1.16(VCC) ADDR-R/P-SW-2.16(VCC) ADDR-R/P-SW-3.16(VCC) ALU-BUF.20(VCC) AT28C16-0.24(VCC) AT28C16-1.24(VCC) AT28C16-2.24(VCC) AT28C16-3.24(VCC) CHIP-SELECT-REG-0.16(VCC) DATA-R/P-SW-0.16(VCC) DATA-R/P-SW-1.16(VCC) DEMUX-2X4-0.16(P:VCC) DUAL-4X1-MUX-0.16(VCC) DUAL-4X1-MUX-1.16(VCC) DUAL-4X1-MUX-2.16(VCC) DUAL-4X1-MUX-3.16(VCC) EEPROM-AT28C16.24(VCC) IC1.14(P:VCC) IC2.14(P:VCC) IC3.14(P:VCC) IC4.14(P:VCC) IC5.14(P:VCC) IC6.14(P:VCC) IC7.14(P:VCC) IC8.14(P:VCC) IC9.14(P:VCC) IC10.14(P:VCC) IC11.24(VCC) IC12.16(P:VCC) IC35.14(P:VCC) IC37.14(P:VCC) IC38.14(P:VCC) IC39.14(P:VCC) IC41.14(P:VCC) IC42.14(P:VCC) IC44.14(P:VCC) IC45.14(P:VCC) IC46.14(P:VCC) IC47.14(P:VCC) IC48.14(P:VCC) IC50.14(P:VCC) IC51.14(P:VCC) IC52.14(P:VCC) IC54.14(P:VCC) IC55.14(P:VCC) IC57.14(P:VCC) IC58.14(P:VCC) JK-FLIP-FLOP.5(P:VCC) MEM-BUF.20(VCC) MEM-INT-BUF-0.20(VCC) MEM-INT-BUF-1.20(VCC) MEM-INT-BUF-2.20(VCC) PAGE-ADDR-REG-0.16(VCC) PC-BUF-H.20(VCC) PC-BUF-L.20(VCC) REG-ACU-BUF0.20(VCC) REG-ACU-BUF1.20(VCC) REG-ACU-H.16(VCC) REG-ACU-L.16(VCC) REG-IO0-BUF.20(VCC) REG-IO0-H.16(VCC) REG-IO0-L.16(VCC) REG-IO1-BUF.20(VCC) REG-IO1-H.16(VCC) REG-IO1-L.16(VCC) REG-IO2-BUF.20(VCC) REG-IO2-H.16(VCC) REG-IO2-L.16(VCC) REG-IO3-BUF.20(VCC) REG-IO3-H.16(VCC) REG-IO3-L.16(VCC) REG-IR-BUF.20(VCC) REG-IR-H.16(VCC) REG-IR-L.16(VCC) REG-MAR-BUF.20(VCC) REG-MAR-H.16(VCC) REG-MAR-L.16(VCC) REG-MBR-BUF0.20(VCC) REG-MBR-BUF1.20(VCC) REG-MBR-H.16(VCC) REG-MBR-L.16(VCC) RST-INVERTER.14(P:VCC)

## Library data of the parts
4BIT-FULL-ADDER-2 4BIT-FULL-ADDER-3 = 74xx-eu:74*283: 4-bit binary FULL ADDER, fast carry
74LS161N 74LS161N-0 74LS161N-1-74LS161N-3 = 74xx-eu:74*160: Synchronous 4-bit COUNTER
ADDR-R/P-SW-0 ADDR-R/P-SW-1-ADDR-R/P-SW-3 DATA-R/P-SW-0 DATA-R/P-SW-1 = 74xx-eu:74*157: Quadruple 2-line to 1-line data SELECTOR/MULTIPLEXER
ALU-BUF MEM-BUF MEM-INT-BUF-0 MEM-INT-BUF-1 MEM-INT-BUF-2 PC-BUF-H PC-BUF-L REG-ACU-BUF0 REG-ACU-BUF1 REG-IO0-BUF REG-IO1-BUF REG-IO2-BUF REG-IO3-BUF REG-IR-BUF REG-MAR-BUF REG-MBR-BUF0 REG-MBR-BUF1 = 74xx-eu:74*245: Octal BUS TRANSCEIVER, 3-state
AT28C16-0 AT28C16-1-AT28C16-3 EEPROM-AT28C16 = memory:2816: MEMORY
C1 C3 C4 = resistor:C-EU: CAPACITOR, European symbol
C2 = rcl:CPOL-EU: POLARIZED CAPACITOR, European symbol; SPICEPREFIX: C
CHIP-SELECT-REG-0 PAGE-ADDR-REG-0 REG-ACU-H REG-ACU-L REG-IO0-H REG-IO0-L REG-IO1-H REG-IO1-L REG-IO2-H REG-IO2-L REG-IO3-H REG-IO3-L REG-IR-H REG-IR-L REG-MAR-H REG-MAR-L REG-MBR-H REG-MBR-L = 74xx-eu:74*173: 4-bit D type REGISTER, 3-state
CLK SEG-SWITCH = linear:*555: TIMER
DEMUX-2X4-0 IC12 = 74xx-eu:74*139: Dual 2-line to 4-line DECODER/DEMULTIPLEXER
DUAL-4X1-MUX-0 DUAL-4X1-MUX-1-DUAL-4X1-MUX-3 = 74xx-eu:74*153: Dual 4-line to 1-line data SELECTOR/MULTIPLEXER
IC1-IC8 IC10 RST-INVERTER = 74xx-eu:74*04: Hex INVERTER
IC9 = 74xx-eu:74*00: Quad 2-input NAND gate
IC11 = 74xx-eu:74*154: 4-line to 16-line data SELECTOR/MULTIPLEXER
IC35 IC39 IC42 IC45 IC48 IC52 IC55 IC58 = 74xx-eu:74*32: Quad 2-input OR gate
IC37 IC38 IC41 IC44 IC50 IC51 IC54 IC57 = 74xx-eu:74*08: Quad 2-input AND gate
IC46 IC47 = 74xx-eu:74*86: Quad 2-input EXCLUSIVE-OR (XOR) gate
JK-FLIP-FLOP = 74xx-eu:74*76: Dual J-K FLIP FLOP, preset and clear
LED0 LED1-LED99 = led:LED: LED OSRAM: - CHIPLED LG R971, LG N971, LY N971, LG Q971, LY Q971, LO R971, LY R971 LH N974, LH R974 LS Q976, LO Q976, LY Q976 LO Q996 - Hyper CHIPLED LW Q18S LB Q993, LB Q99A, LB R99A - SideLED LS A670, LO A670, LY A670, LG A670, LP A670 LB A673, LV A673, LT A673, LW A673 LH A674 LY A675 LS A676, LA A676, LO A676, LY A676, LW A676 LS A679, LY A679, LG A679 - Hyper Micro SIDELED® LS Y876, LA Y876, LO Y876, LY Y876 LT Y87S - SmartLED LW L88C, LW L88S LB L89C, LB L89S, LG L890 LS L89K, LO L89K, LY L89K LS L896, LA L896, LO L896, LY L896 - TOPLED LS T670, LO T670, LY T670, LG T670, LP T670 LSG T670, LSP T670, LSY T670, LOP T670, LYG T670 LG T671, LOG T671, LSG T671 LB T673, LV T673, LT T673, LW T673 LH T674 LS T676, LA T676, LO T676, LY T676, LB T676, LH T676, LSB T676, LW T676 LB T67C, LV T67C, LT T67C, LS T67K, LO T67K, LY T67K, LW E67C LS E67B, LA E67B, LO E67B, LY E67B, LB E67C, LV E67C, LT E67C LW T67C LS T679, LY T679, LG T679 LS T770, LO T770, LY T770, LG T770, LP T770 LB T773, LV T773, LT T773, LW T773 LH T774 LS E675, LA E675, LY E675, LS T675 LS T776, LA T776, LO T776, LY T776, LB T776 LHGB T686 LT T68C, LB T68C - Hyper Mini TOPLED® LB M676 - Mini TOPLED Santana® LG M470 LS M47K, LO M47K, LY M47K Source: http://www.osram.convergy.de LUXEON: - LUMILED® LXK2-PW12-R00, LXK2-PW12-S00, LXK2-PW14-U00, LXK2-PW14-V00 LXK2-PM12-R00, LXK2-PM12-S00, LXK2-PM14-U00 LXK2-PE12-Q00, LXK2-PE12-R00, LXK2-PE12-S00, LXK2-PE14-T00, LXK2-PE14-U00 LXK2-PB12-K00, LXK2-PB12-L00, LXK2-PB12-M00, LXK2-PB14-N00, LXK2-PB14-P00, LXK2-PB14-Q00 LXK2-PR12-L00, LXK2-PR12-M00, LXK2-PR14-Q00, LXK2-PR14-R00 LXK2-PD12-Q00, LXK2-PD12-R00, LXK2-PD12-S00 LXK2-PH12-R00, LXK2-PH12-S00 LXK2-PL12-P00, LXK2-PL12-Q00, LXK2-PL12-R00 Source: www.luxeon.com KINGBRIGHT: KA-3528ASYC Source: www.kingbright.com
MEMORY-0-8KX8-6264 MEMORY-1-8KX8-6264 MEMORY-2-8KX8-6264 MEMORY-3-8KX8-6264 = memory-hitachi:6264A: MEMORY; OC_FARNELL: 283605; OC_NEWARK: unknown
PROG/RUN-ADDR-SW = special:SW_DIP-12: DIP SWITCH
PROG/RUN-DATA-SW = special:SW_DIP-8: DIP SWITCH
Q1 = transistor-pnp:BC556*: PNP Transistror
Q2 = transistor-small-signal:BS170: N-CHANNEL MOS FET
R1 R3-R9 = resistor:R-EU_: RESISTOR, European symbol
R2 = pot:3RP/1610N: 16mm Potentiometer one level Source: http://www.alphapotentiometers.net/html/16mm_pot_2.html
S1 S3 = switch-omron:10-XX: OMRON SWITCH; MPN: B3F-1000; OC_FARNELL: 176432; OC_NEWARK: 36M3542
S2 = switch-misc:9077-1: MARQUARDT SWITCH 9077.0100 Distributor: Buerklin <https://www.buerklin.com/default.asp?event=ShowArtikel%2812G2820%29&l=d&jump=ArtNr_12G2820>
SEG-DISP0 SEG-DISP1-SEG-DISP3 = special:7SEG-CK: 7-segment DISPLAY single cathode, 13 mm
SW2 SW3 = special:SW_DIP-1: DIP SWITCH